# EAGLE design MotionBoard Rev B (EAGLE 7.3.0)

## Sheet 1 of 2
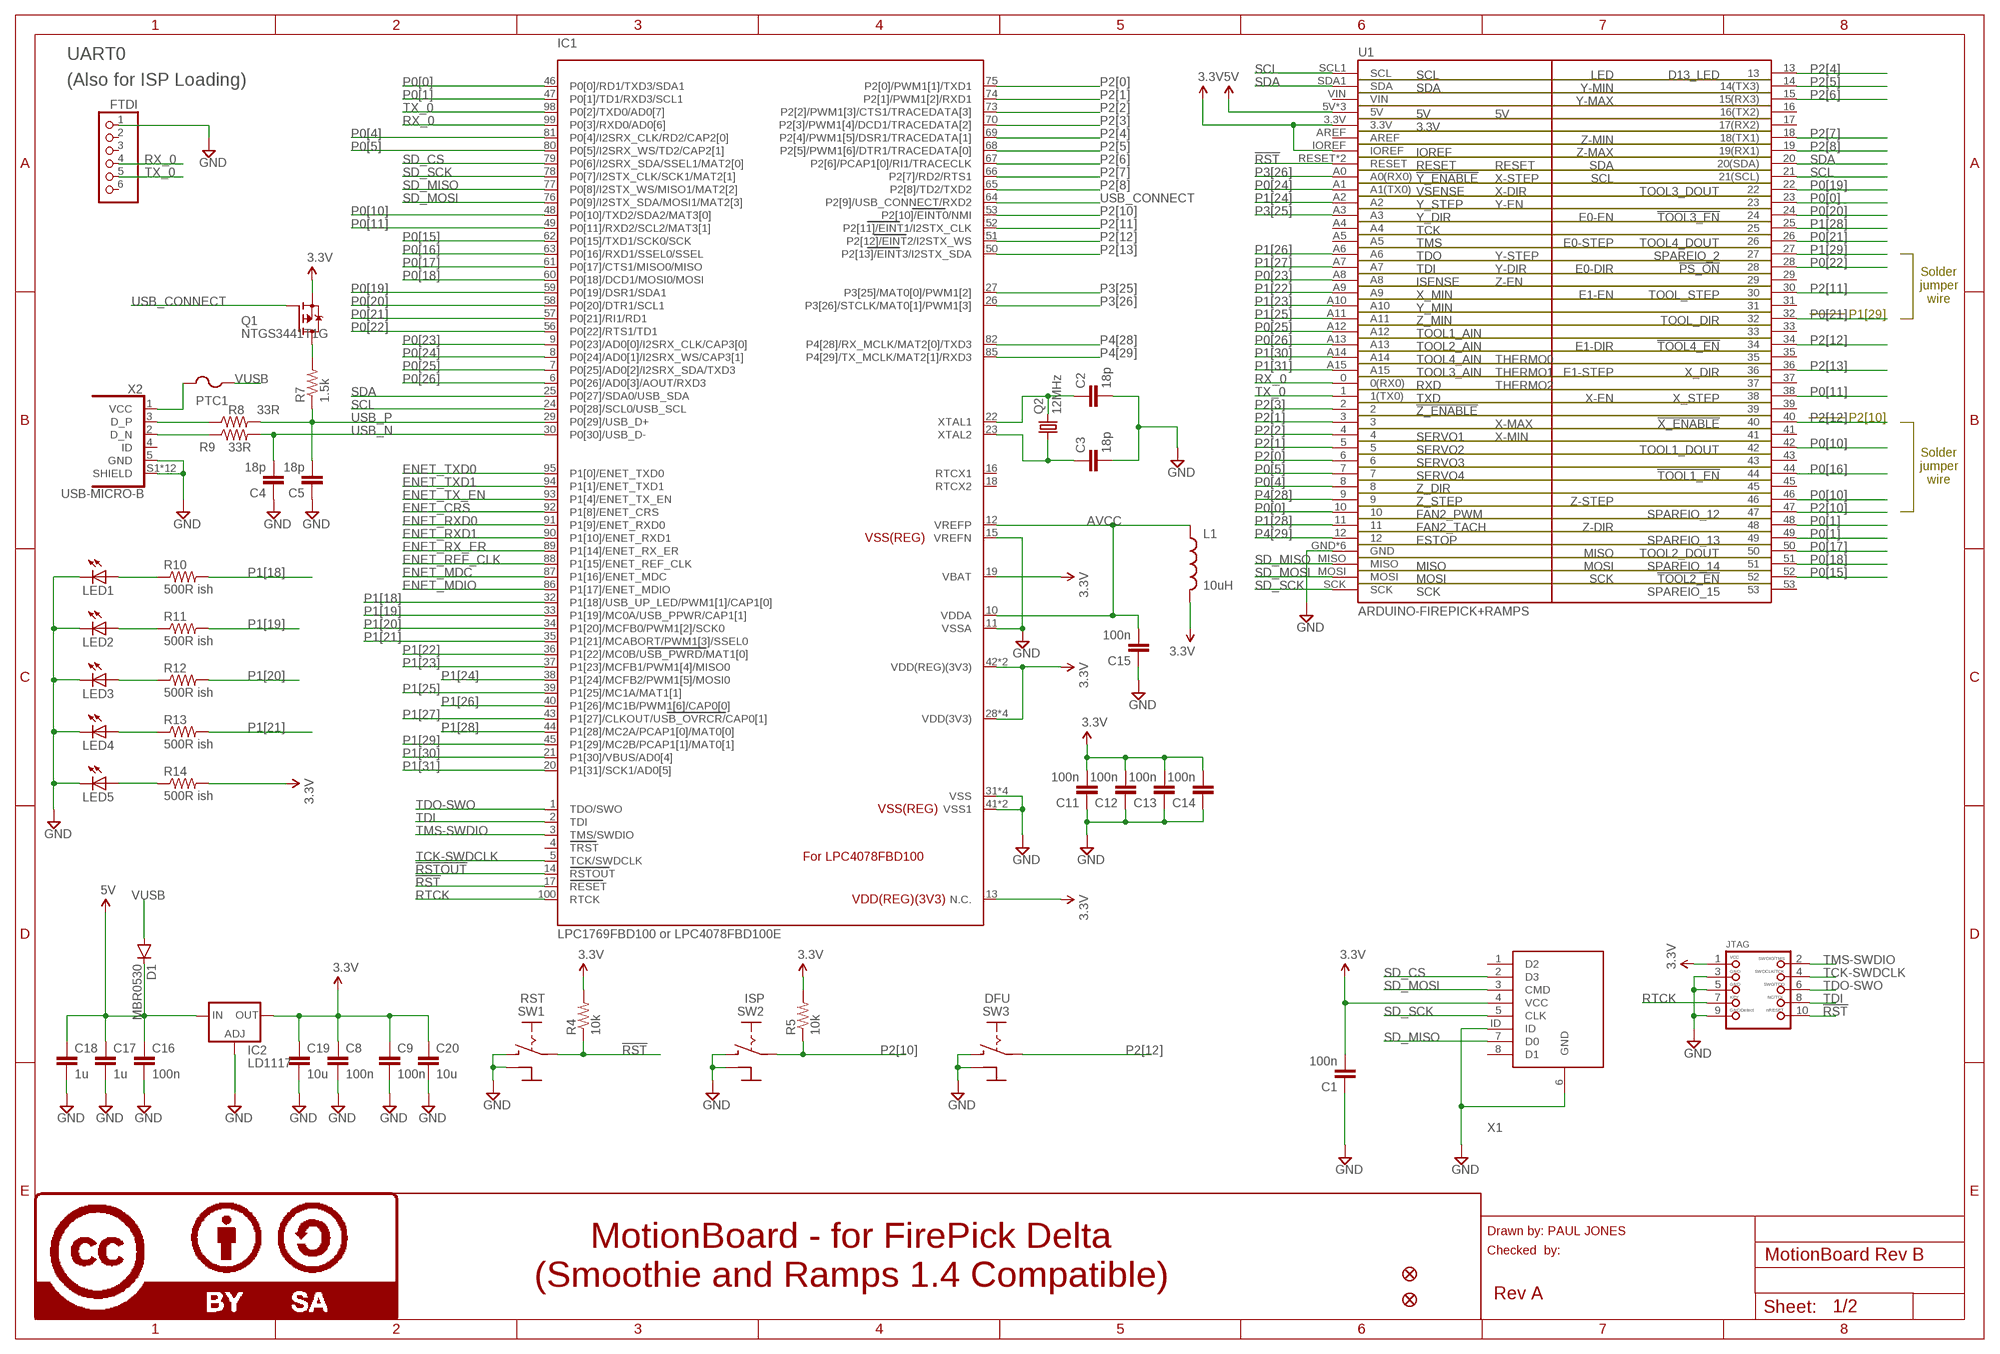
[diagram p0: schematic, sheet 1]

### Parts
C1  100n  CAP0603  [0603]
C2  18p  CAP0603  [0603]
C3  18p  CAP0603  [0603]
C4  18p  CAP0603  [0603]
C5  18p  CAP0603  [0603]
C8  100n  CAP0603  [0603]
C9  100n  CAP0603  [0603]
C11  100n  CAP0603  [0603]
C12  100n  CAP0603  [0603]
C13  100n  CAP0603  [0603]
C14  100n  CAP0603  [0603]
C15  100n  CAP0603  [0603]
C16  100n  CAP0603  [0603]
C17  1u  CAP0603  [0603]
C18  1u  CAP0603  [0603]
C19  10u  CAP0603  [0603]
C20  10u  CAP0603  [0603]
D1  MBR0530  DIODESOD123  [SOD-123]
DFU  SW3  TOGGLE-SW-SMD  [TOGGLE-SW-SMD]
FID5  FIDUCIAL1X2  [FIDUCIAL-1X2]
FID6  FIDUCIAL1X2  [FIDUCIAL-1X2]
FTDI  PINHD-1X6  [1X06]
IC1  LPC1769FBD100 or LPC4078FBD100E  LPC1768  [LQFP100]
IC2  LD1117  LD117AS12TR  [SOT223]
ISP  SW2  TOGGLE-SW-SMD  [TOGGLE-SW-SMD]
JTAG  JTAG-CORTEXM3  [2X05_1.27MM_SMT]
L1  10uH  INDUCTOR0603  [0603]
LED1  LED  [LED-1206-BOTTOM]
LED2  LED  [LED-1206-BOTTOM]
LED3  LED  [LED-1206-BOTTOM]
LED4  LED  [LED-1206-BOTTOM]
LED5  LED  [LED-1206-BOTTOM]
LOGO6  LOGO-CC-BY-SAMEDIUM  [LOGO-CC-BY-SA-MEDIUM]
PTC1  PTCFUSE-1812  [1812]
Q1  NTGS3441T1G  BSL207SP  [SC74_INFINEON]
Q2  12MHz  CRYSTALHC49UP  [HC49UP]
R4  10k  R-US_R0603  [R0603]
R5  10k  R-US_R0603  [R0603]
R7  1.5k  R-US_R0603  [R0603]
R8  33R  R-US_R0603  [R0603]
R9  33R  R-US_R0603  [R0603]
R10  500R ish  R-US_R0603  [R0603]
R11  500R ish  R-US_R0603  [R0603]
R12  500R ish  R-US_R0603  [R0603]
R13  500R ish  R-US_R0603  [R0603]
R14  500R ish  R-US_R0603  [R0603]
RST  SW1  TOGGLE-SW-SMD  [TOGGLE-SW-SMD]
U1  ARDUINO-FIREPICK+RAMPS  [ARDUINO_MEGA_NEW]
X1  ST9S008V4AR1500  [ST9S008V4AR1500]
X2  USB-MICRO-B  [FCI-10118194-0001LF]

### Nets
3.3V: C1.2 C8.1 C9.1 C11.2 C12.2 C13.2 C14.2 C19.1 C20.1 IC1.13(N.C.) IC1.19(VBAT) IC1.28(VDD(3V3)) IC1.42(VDD(REG)(3V3)) IC1.54(VDD(3V3)) IC1.71(VDD(3V3)) IC1.84(VDD(REG)(3V3)) IC1.96(VDD(3V3)) IC2.4(OUT) JTAG.1 L1.2 Q1.4(S) R4.2 R5.2 R14.2 U1.3.3V U1.IOREF X1.4(VCC) ; also sheet 2
5V: C16.1 C17.1 C18.1 D1.C IC2.3(IN) U1.5V U1.5V@1(5V) U1.5V@2(5V)
!RST: IC1.17(RESET) JTAG.10 R4.1 RST.3(I) RST.4(I) U1.RESET U1.RST(RESET)
!RSTOUT: IC1.14(RSTOUT) ; also sheet 2
AVCC: C15.2 IC1.10(VDDA) IC1.12(VREFP) L1.1
D_N: R9.1 X2.2(D_N)
D_P: R8.1 X2.3(D_P)
ENET_CRS: IC1.92(P1[8]/ENET_CRS) ; also sheet 2
ENET_MDC: IC1.87(P1[16]/ENET_MDC) ; also sheet 2
ENET_MDIO: IC1.86(P1[17]/ENET_MDIO) ; also sheet 2
ENET_REF_CLK: IC1.88(P1[15]/ENET_REF_CLK) ; also sheet 2
ENET_RX_ER: IC1.89(P1[14]/ENET_RX_ER) ; also sheet 2
ENET_RXD0: IC1.91(P1[9]/ENET_RXD0) ; also sheet 2
ENET_RXD1: IC1.90(P1[10]/ENET_RXD1) ; also sheet 2
ENET_TX_EN: IC1.93(P1[4]/ENET_TX_EN) ; also sheet 2
ENET_TXD0: IC1.95(P1[0]/ENET_TXD0) ; also sheet 2
ENET_TXD1: IC1.94(P1[1]/ENET_TXD1) ; also sheet 2
GND: C1.1 C2.2 C3.2 C4.1 C5.1 C8.2 C9.2 C11.1 C12.1 C13.1 C14.1 C15.1 C16.2 C17.2 C18.2 C19.2 C20.2 DFU.1(C) DFU.2(C) DFU.GND FTDI.1 IC1.11(VSSA) IC1.15(VREFN) IC1.31(VSS) IC1.41(VSS1) IC1.55(VSS) IC1.72(VSS) IC1.83(VSS1) IC1.97(VSS) IC2.1(ADJ) ISP.1(C) ISP.2(C) ISP.GND JTAG.3 JTAG.5 JTAG.9 LED1.C LED2.C LED3.C LED4.C LED5.C RST.1(C) RST.2(C) RST.GND U1.GND U1.GND@0(GND) U1.GND@1(GND) U1.GND@2(GND) U1.GND@3(GND) U1.GNDI(GND) X1.6(GND) X1.ID X2.5(GND) X2.S1(SHIELD) X2.S2(SHIELD) X2.S3(SHIELD) X2.S4(SHIELD) X2.S5(SHIELD) X2.S6(SHIELD) X2.S7(SHIELD) X2.S8(SHIELD) X2.S9(SHIELD) X2.S10(SHIELD) X2.S11(SHIELD) X2.S12(SHIELD) ; also sheet 2
N$1: C2.1 IC1.22(XTAL1) Q2.2
N$2: C3.1 IC1.23(XTAL2) Q2.1
N$9: PTC1.2 X2.1(VCC)
N$51: Q1.1(D) Q1.2(D) Q1.5(D) Q1.6(D) R7.2
N$80: LED5.A R14.1
N$84: LED4.A R13.1
N$85: LED3.A R12.1
N$86: LED2.A R11.1
N$87: LED1.A R10.1
P0[0]: IC1.46(P0[0]/RD1/TXD3/SDA1) U1.10 U1.23
P0[1]: IC1.47(P0[1]/TD1/RXD3/SCL1) U1.48 U1.49
P0[4]: IC1.81(P0[4]/I2SRX_CLK/RD2/CAP2[0]) U1.8
P0[5]: IC1.80(P0[5]/I2SRX_WS/TD2/CAP2[1]) U1.7
P0[10]: IC1.48(P0[10]/TXD2/SDA2/MAT3[0]) U1.42 U1.46
P0[11]: IC1.49(P0[11]/RXD2/SCL2/MAT3[1]) U1.38
P0[15]: IC1.62(P0[15]/TXD1/SCK0/SCK) U1.52
P0[16]: IC1.63(P0[16]/RXD1/SSEL0/SSEL) U1.44
P0[17]: IC1.61(P0[17]/CTS1/MISO0/MISO) U1.50
P0[18]: IC1.60(P0[18]/DCD1/MOSI0/MOSI) U1.51
P0[19]: IC1.59(P0[19]/DSR1/SDA1) U1.22
P0[20]: IC1.58(P0[20]/DTR1/SCL1) U1.24
P0[21]: IC1.57(P0[21]/RI1/RD1) U1.26 U1.32
P0[22]: IC1.56(P0[22]/RTS1/TD1) U1.28
P0[23]: IC1.9(P0[23]/AD0[0]/I2SRX_CLK/CAP3[0]) U1.A8
P0[24]: IC1.8(P0[24]/AD0[1]/I2SRX_WS/CAP3[1]) U1.A1(A1(TX0))
P0[25]: IC1.7(P0[25]/AD0[2]/I2SRX_SDA/TXD3) U1.A12
P0[26]: IC1.6(P0[26]/AD0[3]/AOUT/RXD3) U1.A13
P1[18]: IC1.32(P1[18]/USB_UP_LED/PWM1[1]/CAP1[0]) R10.2
P1[19]: IC1.33(P1[19]/MC0A/USB_PPWR/CAP1[1]) R11.2
P1[20]: IC1.34(P1[20]/MCFB0/PWM1[2]/SCK0) R12.2
P1[21]: IC1.35(P1[21]/MCABORT/PWM1[3]/SSEL0) R13.2
P1[22]: IC1.36(P1[22]/MC0B/USB_PWRD/MAT1[0]) U1.A9
P1[23]: IC1.37(P1[23]/MCFB1/PWM1[4]/MISO0) U1.A10
P1[24]: IC1.38(P1[24]/MCFB2/PWM1[5]/MOSI0) U1.A2
P1[25]: IC1.39(P1[25]/MC1A/MAT1[1]) U1.A11
P1[26]: IC1.40(P1[26]/MC1B/PWM1[6]/CAP0[0]) U1.A6
P1[27]: IC1.43(P1[27]/CLKOUT/USB_OVRCR/CAP0[1]) U1.A7
P1[28]: IC1.44(P1[28]/MC2A/PCAP1[0]/MAT0[0]) U1.11 U1.25
P1[29]: IC1.45(P1[29]/MC2B/PCAP1[1]/MAT0[1]) U1.27
P1[30]: IC1.21(P1[30]/VBUS/AD0[4]) U1.A14
P1[31]: IC1.20(P1[31]/SCK1/AD0[5]) U1.A15
P2[0]: IC1.75(P2[0]/PWM1[1]/TXD1) U1.6
P2[1]: IC1.74(P2[1]/PWM1[2]/RXD1) U1.3 U1.5
P2[2]: IC1.73(P2[2]/PWM1[3]/CTS1/TRACEDATA[3]) U1.4
P2[3]: IC1.70(P2[3]/PWM1[4]/DCD1/TRACEDATA[2]) U1.2
P2[4]: IC1.69(P2[4]/PWM1[5]/DSR1/TRACEDATA[1]) U1.13
P2[5]: IC1.68(P2[5]/PWM1[6]/DTR1/TRACEDATA[0]) U1.14(14(TX3))
P2[6]: IC1.67(P2[6]/PCAP1[0]/RI1/TRACECLK) U1.15(15(RX3))
P2[7]: IC1.66(P2[7]/RD2/RTS1) U1.18(18(TX1))
P2[8]: IC1.65(P2[8]/TD2/TXD2) U1.19(19(RX1))
P2[10]: IC1.53(P2[10]/EINT0/NMI) ISP.3(I) ISP.4(I) R5.1 U1.47
P2[11]: IC1.52(P2[11]/EINT1/I2STX_CLK) U1.30
P2[12]: DFU.3(I) DFU.4(I) IC1.51(P2[12]/EINT2/I2STX_WS) U1.34 U1.40
P2[13]: IC1.50(P2[13]/EINT3/I2STX_SDA) U1.36
P3[25]: IC1.27(P3[25]/MAT0[0]/PWM1[2]) U1.A3
P3[26]: IC1.26(P3[26]/STCLK/MAT0[1]/PWM1[3]) U1.A0(A0(RX0))
P4[28]: IC1.82(P4[28]/RX_MCLK/MAT2[0]/TXD3) U1.9
P4[29]: IC1.85(P4[29]/TX_MCLK/MAT2[1]/RXD3) U1.12
RTCK: IC1.100(RTCK) JTAG.7
RX_0: FTDI.4 IC1.99(P0[3]/RXD0/AD0[6]) U1.0(0(RX0))
SCL: IC1.24(P0[28]/SCL0/USB_SCL) U1.21(21(SCL)) U1.SCL1(SCL)
SD_CS: IC1.79(P0[6]/I2SRX_SDA/SSEL1/MAT2[0]) X1.2(D3)
SD_MISO: IC1.77(P0[8]/I2STX_WS/MISO1/MAT2[2]) U1.MISO X1.7(D0)
SD_MOSI: IC1.76(P0[9]/I2STX_SDA/MOSI1/MAT2[3]) U1.MOSI X1.3(CMD)
SD_SCK: IC1.78(P0[7]/I2STX_CLK/SCK1/MAT2[1]) U1.SCK X1.5(CLK)
SDA: IC1.25(P0[27]/SDA0/USB_SDA) U1.20(20(SDA)) U1.SDA1(SDA)
TCK-SWDCLK: IC1.5(TCK/SWDCLK) JTAG.4
TDI: IC1.2(TDI) JTAG.8
TDO-SWO: IC1.1(TDO/SWO) JTAG.6
TMS-SWDIO: IC1.3(TMS/SWDIO) JTAG.2
TX_0: FTDI.5 IC1.98(P0[2]/TXD0/AD0[7]) U1.1(1(TX0))
USB_CONNECT: IC1.64(P2[9]/USB_CONNECT/RXD2) Q1.3(G)
USB_N [USB]: C4.2 IC1.30(P0[30]/USB_D-) R9.2
USB_P [USB]: C5.2 IC1.29(P0[29]/USB_D+) R7.1 R8.2
VUSB: D1.A PTC1.1
Unconnected: FTDI.2 FTDI.3 FTDI.6 IC1.4(TRST) IC1.16(RTCX1) IC1.18(RTCX2) U1.16(16(TX2)) U1.17(17(RX2)) U1.29 U1.31 U1.33 U1.35 U1.37 U1.39 U1.41 U1.43 U1.45 U1.53 U1.A4 U1.A5 U1.AREF U1.VIN X1.1(D2) X1.8(D1) X2.4(ID)

### Notes on the sheet
- UART0
- (Also for ISP Loading)
- Solder
  jumper
  wire
- P1[29]
- P2[10]
- Solder
  jumper
  wire
- Drawn by: PAUL JONES
- MotionBoard - for FirePick Delta
  (Smoothie and Ramps 1.4 Compatible)
- Checked  by:
- Rev A

## Sheet 2 of 2
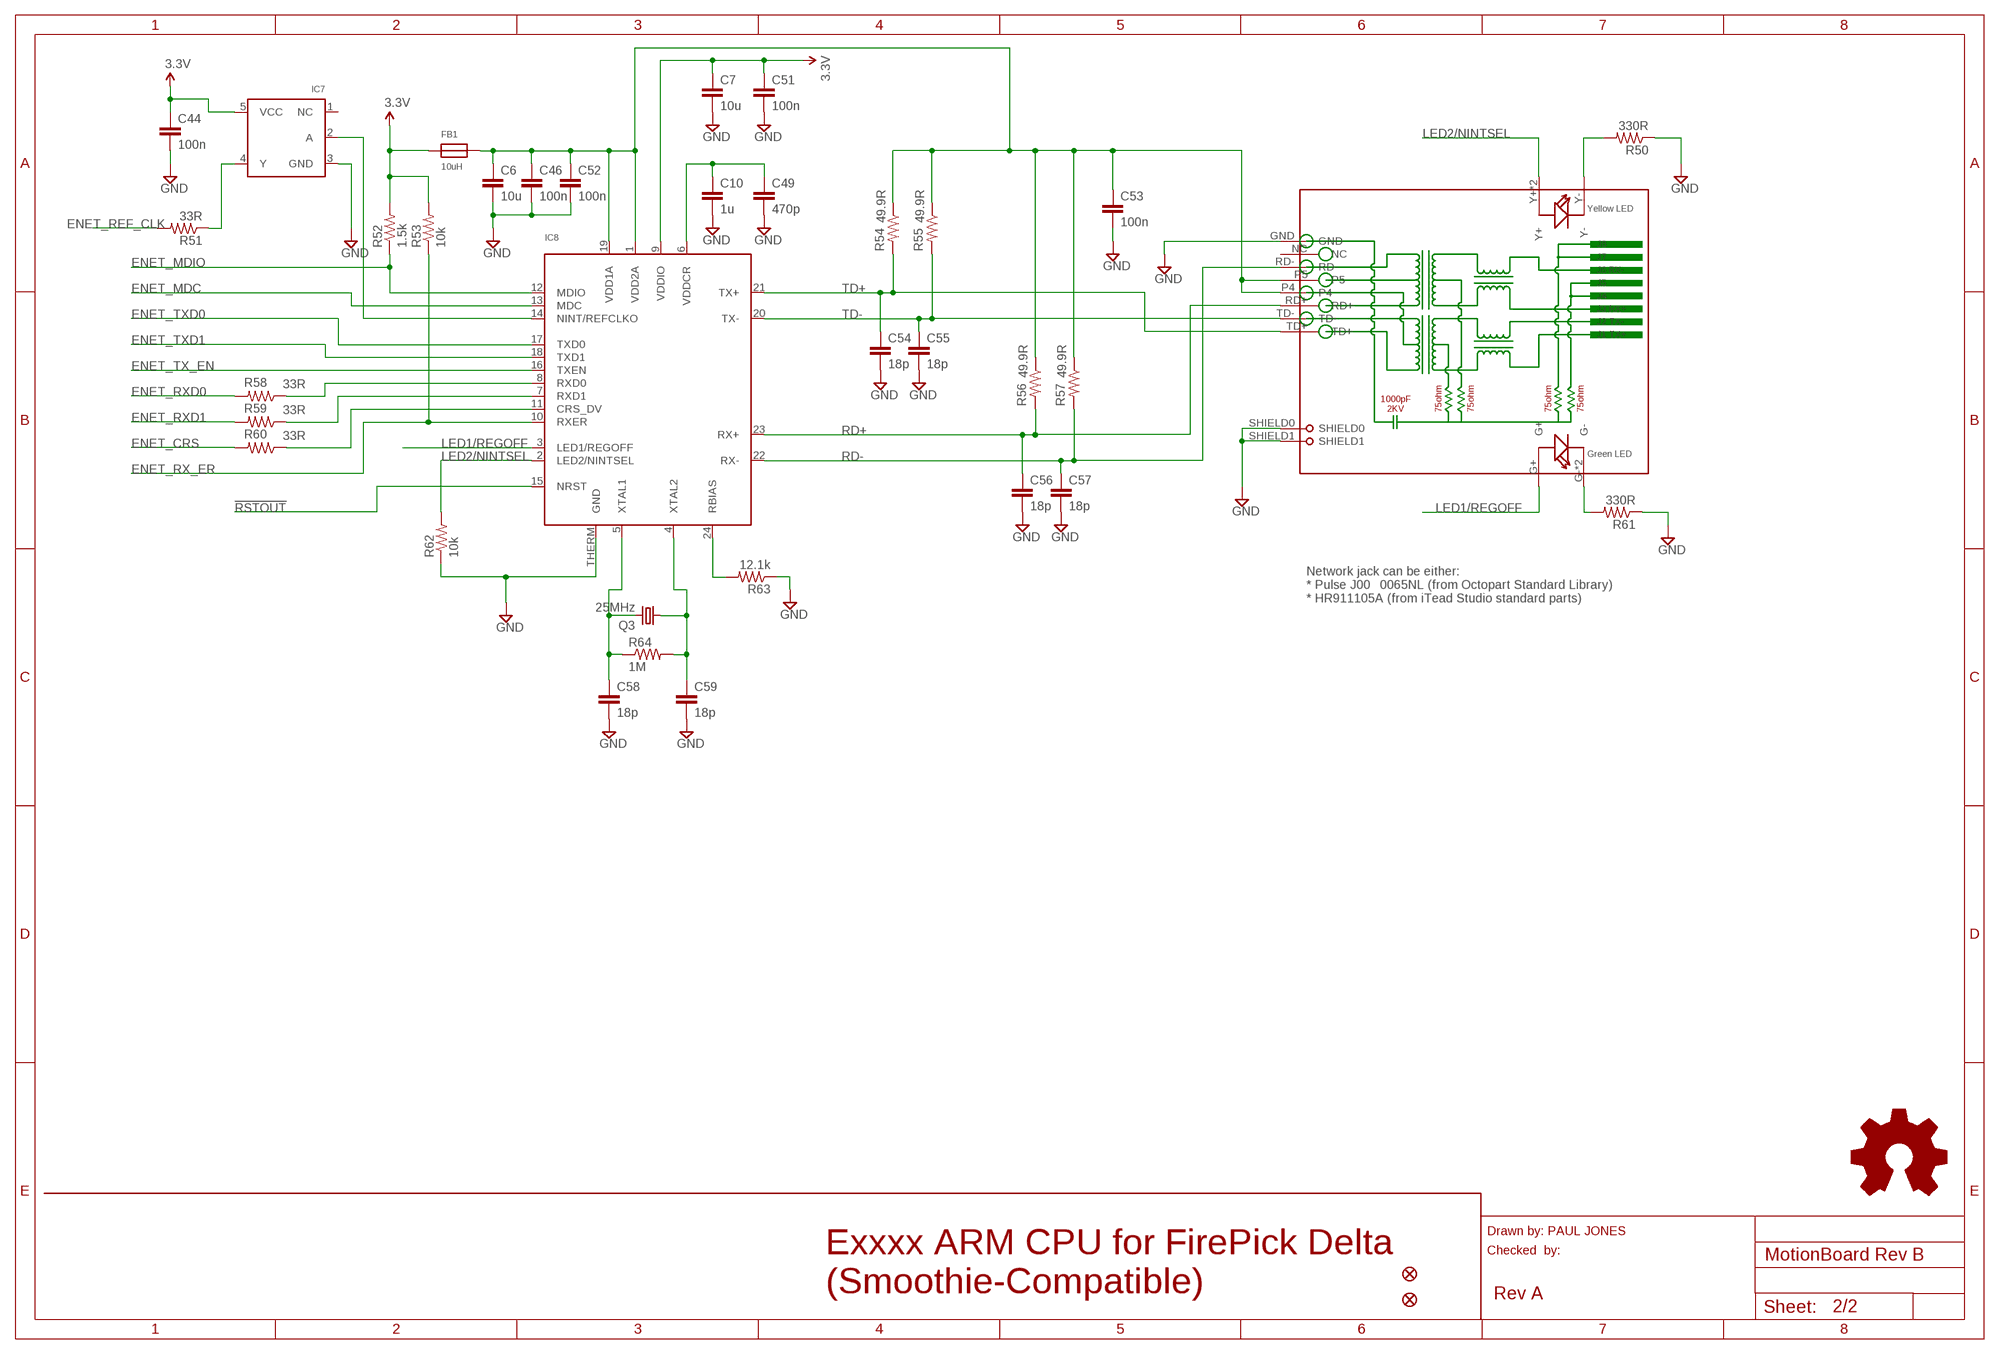
[diagram p1: schematic, sheet 2]

### Parts
C6  10u  CAP0603  [0603]
C7  10u  CAP0603  [0603]
C10  1u  CAP0603  [0603]
C44  100n  CAP0603  [0603]
C46  100n  CAP0603  [0603]
C49  470p  CAP0603  [0603]
C51  100n  CAP0603  [0603]
C52  100n  CAP0603  [0603]
C53  100n  CAP0603  [0603]
C54  18p  CAP0603  [0603]
C55  18p  CAP0603  [0603]
C56  18p  CAP0603  [0603]
C57  18p  CAP0603  [0603]
C58  18p  CAP0603  [0603]
C59  18p  CAP0603  [0603]
FB1  10uH  FERRITE  [0603]
FID17  FIDUCIAL1X2  [FIDUCIAL-1X2]
FID18  FIDUCIAL1X2  [FIDUCIAL-1X2]
IC7  74LVC1G04  [SOT23-5]
IC8  LAN8720  [QFN24_4MM]
LOGO10  LOGO-OSHWSMALL  [LOGO-OSHW-SMALL]
Q3  25MHz  CRYSTALHC49UP  [HC49UP]
R50  330R  R-US_R0603  [R0603]
R51  33R  R-US_R0603  [R0603]
R52  1.5k  R-US_R0603  [R0603]
R53  10k  R-US_R0603  [R0603]
R54  49.9R  R-US_R0603  [R0603]
R55  49.9R  R-US_R0603  [R0603]
R56  49.9R  R-US_R0603  [R0603]
R57  49.9R  R-US_R0603  [R0603]
R58  33R  R-US_R0603  [R0603]
R59  33R  R-US_R0603  [R0603]
R60  33R  R-US_R0603  [R0603]
R61  330R  R-US_R0603  [R0603]
R62  10k  R-US_R0603  [R0603]
R63  12.1k  R-US_R0603  [R0603]
R64  1M  R-US_R0603  [R0603]
RJ1  HR911105A  [HR911105A]

### Nets
3.3V: C7.1 C44.1 C51.1 FB1.1 IC7.5(VCC) IC8.9(VDDIO) R52.2 R53.2 ; also sheet 1
!RSTOUT: IC8.15(NRST) ; also sheet 1
ENET_CRS: R60.2 ; also sheet 1
ENET_MDC: IC8.13(MDC) ; also sheet 1
ENET_MDIO: IC8.12(MDIO) R52.1 ; also sheet 1
ENET_REF_CLK: R51.2 ; also sheet 1
ENET_RX_ER: IC8.10(RXER) R53.1 ; also sheet 1
ENET_RXD0: R58.2 ; also sheet 1
ENET_RXD1: R59.2 ; also sheet 1
ENET_TX_EN: IC8.16(TXEN) ; also sheet 1
ENET_TXD0: IC8.17(TXD0) ; also sheet 1
ENET_TXD1: IC8.18(TXD1) ; also sheet 1
GND: C6.2 C7.2 C10.2 C44.2 C46.2 C49.2 C51.2 C52.2 C53.2 C54.2 C55.2 C56.2 C57.2 C58.2 C59.2 IC7.3(GND) IC8.THERM(GND) R50.1 R61.1 R62.1 R63.1 RJ1.GND RJ1.SHIELD0 RJ1.SHIELD1 ; also sheet 1
LED1/REGOFF: IC8.3(LED1/REGOFF) RJ1.G+
LED2/NINTSEL: IC8.2(LED2/NINTSEL) R62.2 RJ1.Y+ RJ1.Y++(Y+)
N$3: IC8.11(CRS_DV) R60.1
N$4: IC8.24(RBIAS) R63.2
N$12: C10.1 C49.1 IC8.6(VDDCR)
N$15: IC7.2(A) IC8.14(NINT/REFCLKO)
N$20: R61.2 RJ1.G- RJ1.G--(G-)
N$42: IC8.8(RXD0) R58.1
N$47: R50.2 RJ1.Y-
N$55: IC8.7(RXD1) R59.1
N$67: C59.1 IC8.4(XTAL2) Q3.1 R64.2
N$68: C58.1 IC8.5(XTAL1) Q3.2 R64.1
N$78: IC7.4(Y) R51.1
RD+: C56.1 IC8.23(RX+) R56.2 RJ1.RD+
RD-: C57.1 IC8.22(RX-) R57.2 RJ1.RD-
TD+: C54.1 IC8.21(TX+) R54.2 RJ1.TD+
TD-: C55.1 IC8.20(TX-) R55.2 RJ1.TD-
VDD: C6.1 C46.1 C52.1 C53.1 FB1.2 IC8.1(VDD2A) IC8.19(VDD1A) R54.1 R55.1 R56.1 R57.1 RJ1.P4 RJ1.P5
Unconnected: IC7.1(NC) RJ1.NC

### Notes on the sheet
- Network jack can be either:
  * Pulse J00‑0065NL (from Octopart Standard Library)
  * HR911105A (from iTead Studio standard parts)
- Drawn by: PAUL JONES
- Checked  by:
- Exxxx ARM CPU for FirePick Delta
  (Smoothie-Compatible)
- Rev A

## Library data of the parts
C1-C20 C44 C46 C49 C51-C59 = iwt:CAP: Capacitor Standard 0603 ceramic capacitor, and 0.1" leaded capacitor.
D1 = SparkFun-DiscreteSemi:DIODE: Diode These are standard reverse protection diodes and small signal diodes. SMA package can handle up to about 1A. SOD-323 can handle about 200mA. What the SOD-323 package when ordering, there are some mfgs out there that are 5-pin packages.
DFU ISP RST = iwt:TOGGLE-SW-SMD
FB1 = microbuilder:FERRITE: Ferrite Bead 0603 120 Ohm, 600mA Ferrite Chip - Digikey: 445-2164-1-ND
FID5 FID6 FID17 FID18 = SparkFun-Aesthetics:FIDUCIAL: Fiducial Alignment Points Various fiducial points for machine vision alignment.
FTDI = pinhead:PINHD-1X6: PIN HEADER
IC1 = iwt:LPC1768: LPC1768 100 MHz 32-bit ARM Cortex-M3 based microcontroller featuring a high level of integration and low power consumption. 512 kB Flash, 64 kB SRAM, USB Device/Host/OTG, Ethernet, CAN, I2S, 10-bit DAC Digikey: 568-4796-ND
IC2 = v-reg:LD117A?*: Low drop fixed and adjustable positive voltage regulators 1 A Source: http://www.st.com/stonline/products/literature/ds/7194/ld1117axx.pdf
IC7 = microbuilder:74LVC1G04: 74LVC1G04 - Single Inverter Gate SOT23-5 SN74LVC1G04DBVR - Digikey: 296-11599-1-ND
IC8 = microbuilder:LAN8720: LAN8720A 10/100 Ethernet PHY Mouser: 886-LAN8720AI-CP
JTAG = microbuilder:JTAG-CORTEXM3: Serial Wire (SW-DP) Connector This standard 0.05" 10-pin connector is for use with the Cortex M0/M3's native SWD (serial wire debugger) interface (SW-DP). Some boards support a 20-pin combined JTAG+SWD connector (SWJ-DP), such as the LPC1700 family, but many smaller devices only work with SWD which typically use the smaller 10-pin SW-DP connecter (the LPC1300 family, for example, only supports SWD). 2x05 1.27mm/0.05" Connector: This is the standard SMT connector defined by ARM for all Cortex devices, and should be used in most situations and for forward-compatibility since any new devices coming to market will likely use this connector. MOLEX 10 Pin 0.1" Connector: This 0.1" 10 pin connector has the same pin layout as the standard 0.05" connector, but is easier to work with if you are using standard jumper wires or custom cables to connect your SWD hardware. MOLEX 20 Pin 0.1" Connector: This 0.1" 20 pin connector is the same model used for ARM7/ARM9 JTAG debuggers, but is connected to match the pins on the Segger J-Link for ARM (which supports both JTAG and SWD debugging). See the following document from ARM for more information on Cortex M3 Debug Connectors: http://infocenter.arm.com/help/topic/com.arm.doc.faqs/attached/13634/cortex_debug_connectors.pdf And the following page for an overview with images of the different connector types: http://www.keil.com/peripherals/coresight/connectors.asp
L1 = SparkFun:INDUCTOR: Inductors Basic Inductor/Choke - 0603 and 1206. Footprints are not proven and vary greatly between part numbers.
LED1-LED5 = iwt:LED: LEDs Standard schematic elements and footprints for 5mm, 3mm, 1206, and 0603 sized LEDs. 5mm - Spark Fun Electronics SKU : COM-00529 (and others)
LOGO6 = FirePick:LOGO-CC-BY-SA
LOGO10 = FirePick:LOGO-OSHW
PTC1 = adafruit:PTCFUSE: PTC fuses, resettable thermistors
Q1 = transistor-fet:BSL207SP: OptiMOS(R)-P Small-Signal-Transistor P-Channel, Enhancement mode, Super Logic Level (2.5 V rated) Source: http://www.infineon.com/upload/Document/BSL207SP_Rev2.01.pdf
Q2 Q3 = crystal:CRYSTAL: CRYSTAL; OC_FARNELL: unknown; OC_NEWARK: unknown
R4 R5 R7-R14 R50-R64 = resistor:R-US_: RESISTOR, American symbol
RJ1 = FirePick:HR911105A: SOC006
U1 = iwt:ARDUINO-FIREPICK+RAMPS
X1 = ST9S008V4AR1500-598396:ST9S008V4AR1500: http://octopart.com/st9s008v4ar1500-jae+electronics-19043725
X2 = iwt:USB-MICRO-B

## Net classes
1 USB: width 0.305 mm, drill 0.356 mm, clearance 0.254 mm
2 D: width 0.305 mm, drill 0.356 mm, clearance 0.254 mm

## Board
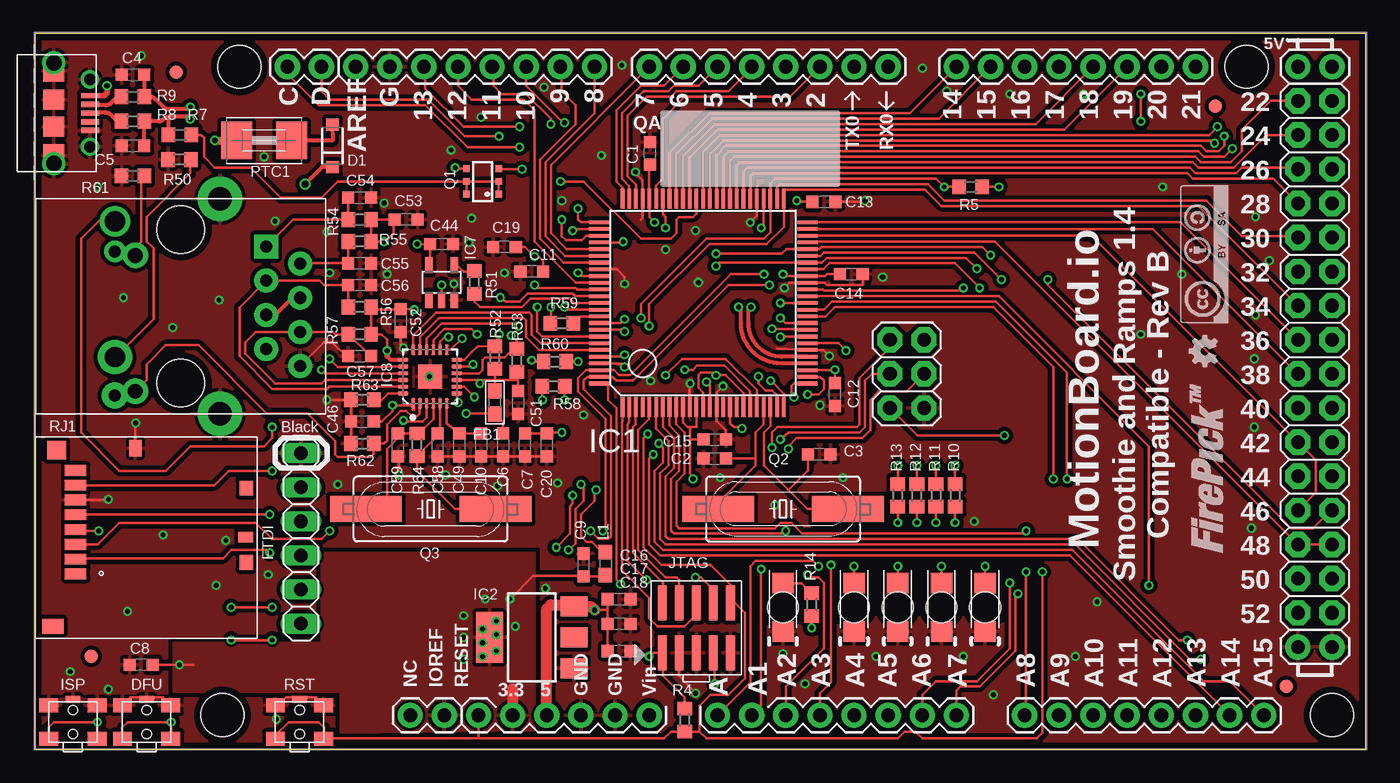
[diagram p2: board, top side]
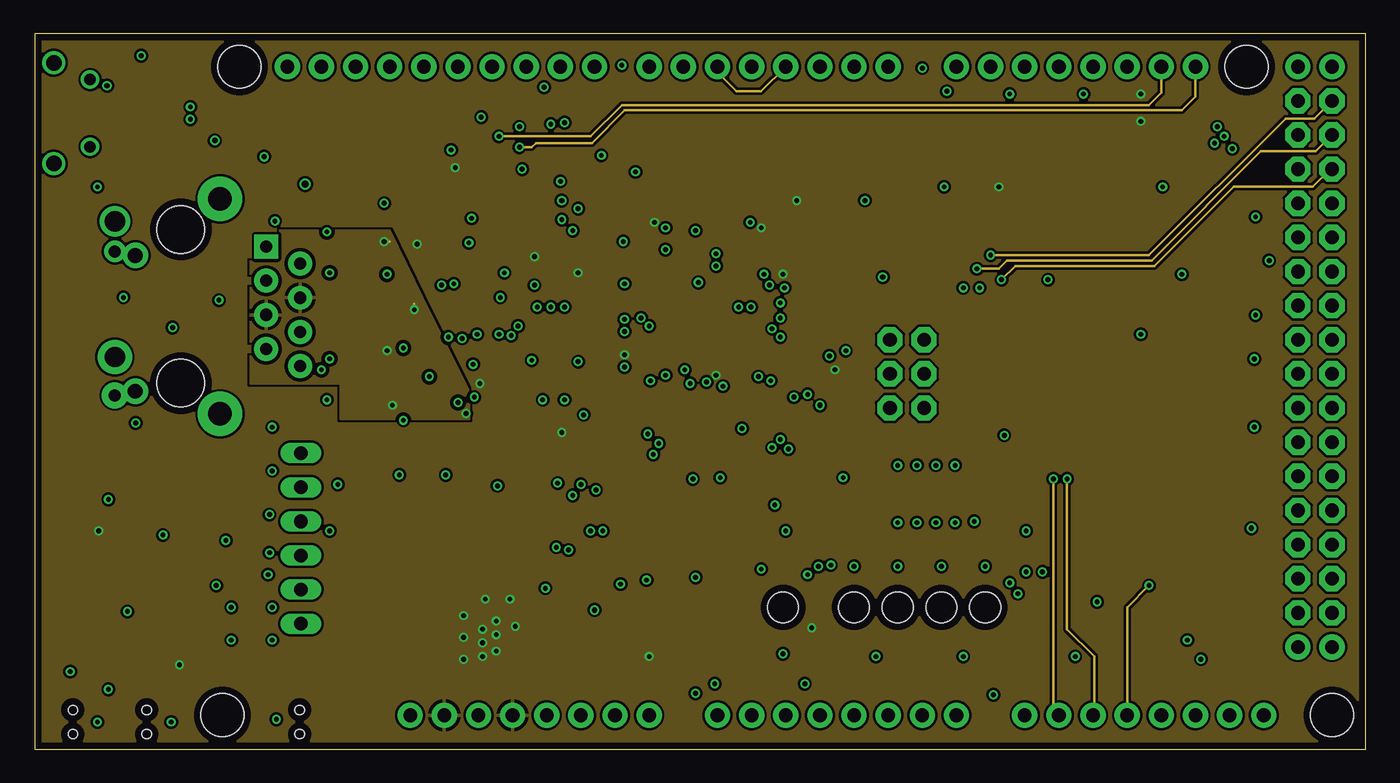
[diagram p3: board, inner layer 3.3]
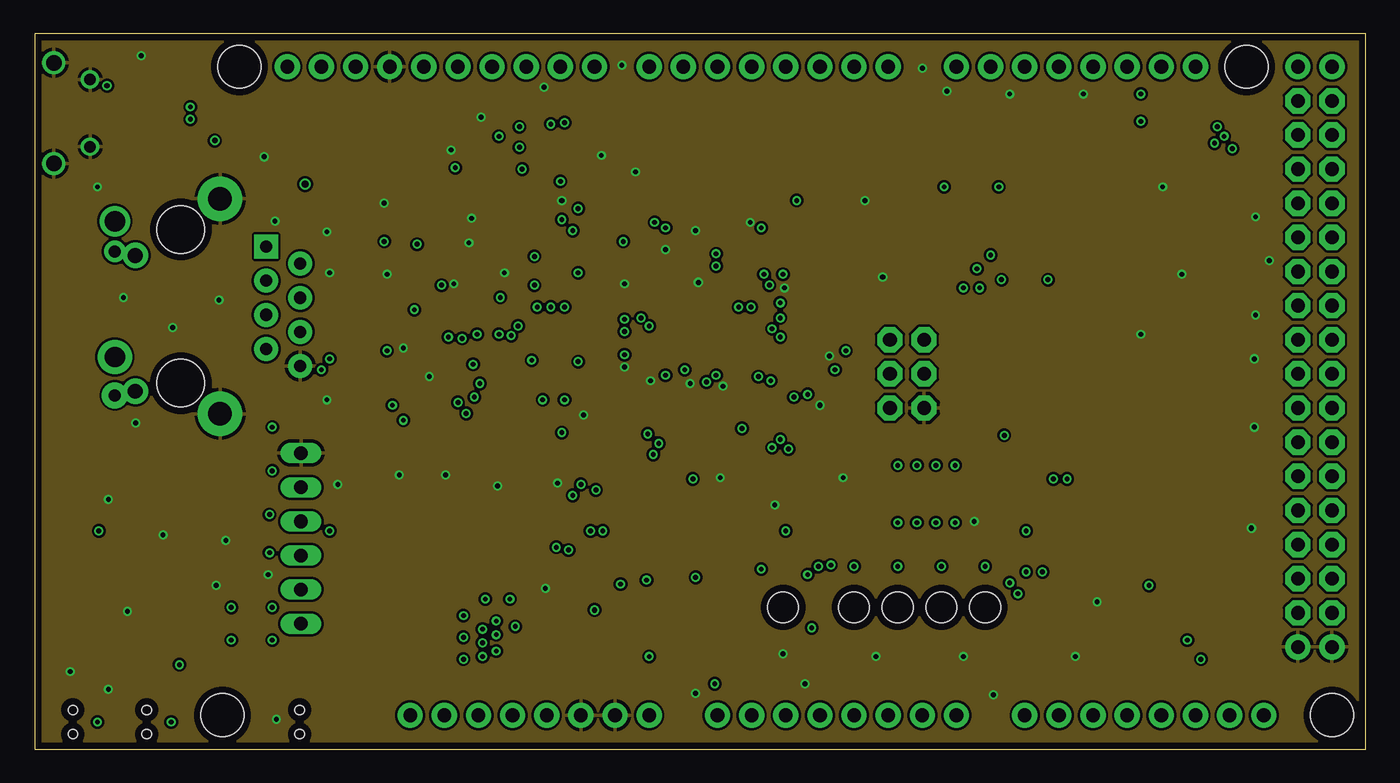
[diagram p4: board, inner layer Gnd]
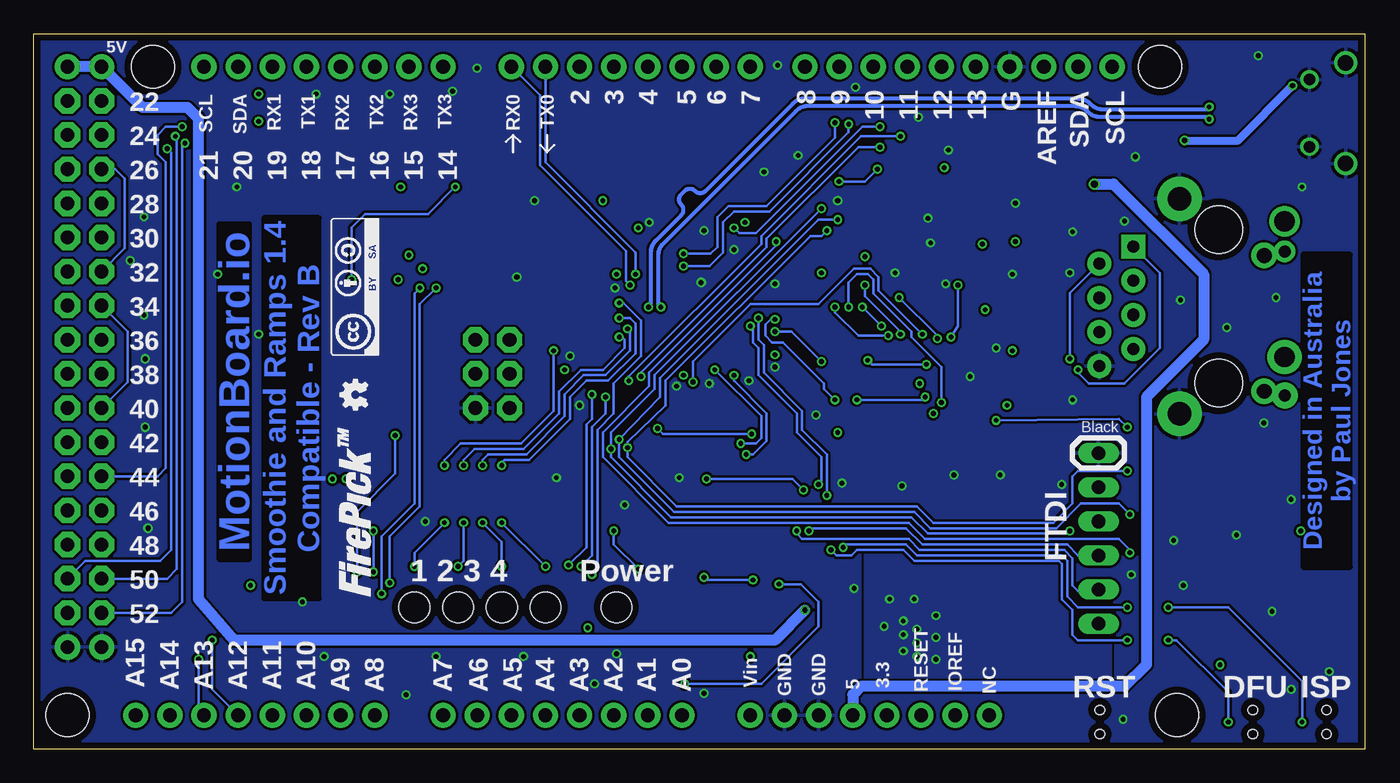
[diagram p5: board, bottom side, seen from below]

Size 99.04 x 53.26 mm. Coordinates in mm from the lower left corner, seen from the top.
Outline: 0,0 99.04,0 99.04,53.26 0,53.26 0,0
Copper layers (1*2*3*16): Top 0.035mm / dielectric 1.5mm / 3.3 0.035mm / dielectric 0.15mm / Gnd 0.035mm / dielectric 0.2mm / Bottom 0.035mm
Design rules "EagleRules *": minimum track width 8mil, minimum drill 12mil, track to track 7mil, track to pad 7mil, pad to pad 7mil, via to via 7mil, smd to smd 0mil, copper to edge 20mil, drill to drill 10mil, minimum pad ring 10mil, minimum via ring 6mil, stop-mask expansion 2mil, vias tented up to drill 25mil, thermal gap 10mil

### Footprints (pad centres in the part's own frame; a part is rotated, then mirrored left to right if it is on the bottom)
0603 = smd 0.9 x 0.9: 1 -0.85,0; 2 0.85,0
SOD-123 = smd 0.9 x 0.95: A 1.575,0; C -1.575,0
TOGGLE-SW-SMD = smd 1.4 x 1.05: 1 -1.8,1.25; 2 1.8,1.25; 3 -1.8,-1.25; 4 1.8,-1.25 | smd 1.1 x 0.5: GND 0,1.7 | hole 0.7: 0,0.9; 0,-0.9
0603' = smd 1.1 x 1: 1 -0.85,0; 2 0.85,0
FIDUCIAL-1X2 = smd 1 x 1: 1 0,0
1X06 = drill 1.016 long: 1 -6.35,0; 2 -3.81,0; 3 -1.27,0; 4 1.27,0; 5 3.81,0; 6 6.35,0
LQFP100 = smd 0.27 x 1.5: 1 -6,-7.75; 2 -5.5,-7.75; 3 -5,-7.75; 4 -4.5,-7.75; 5 -4,-7.75; 6 -3.5,-7.75; 7 -3,-7.75; 8 -2.5,-7.75; 9 -2,-7.75; 10 -1.5,-7.75; 11 -1,-7.75; 12 -0.5,-7.75; 13 0,-7.75; 14 0.5,-7.75; 15 1,-7.75; 16 1.5,-7.75; 17 2,-7.75; 18 2.5,-7.75; 19 3,-7.75; 20 3.5,-7.75; 21 4,-7.75; 22 4.5,-7.75; 23 5,-7.75; 24 5.5,-7.75; 25 6,-7.75; 51 6,7.75; 52 5.5,7.75; 53 5,7.75; 54 4.5,7.75; 55 4,7.75; 56 3.5,7.75; 57 3,7.75; 58 2.5,7.75; 59 2,7.75; 60 1.5,7.75; 61 1,7.75; 62 0.5,7.75; 63 0,7.75; 64 -0.5,7.75; 65 -1,7.75; 66 -1.5,7.75; 67 -2,7.75; 68 -2.5,7.75; 69 -3,7.75; 70 -3.5,7.75; 71 -4,7.75; 72 -4.5,7.75; 73 -5,7.75; 74 -5.5,7.75; 75 -6,7.75 | smd 1.5 x 0.27: 26 7.75,-6; 27 7.75,-5.5; 28 7.75,-5; 29 7.75,-4.5; 30 7.75,-4; 31 7.75,-3.5; 32 7.75,-3; 33 7.75,-2.5; 34 7.75,-2; 35 7.75,-1.5; 36 7.75,-1; 37 7.75,-0.5; 38 7.75,0; 39 7.75,0.5; 40 7.75,1; 41 7.75,1.5; 42 7.75,2; 43 7.75,2.5; 44 7.75,3; 45 7.75,3.5; 46 7.75,4; 47 7.75,4.5; 48 7.75,5; 49 7.75,5.5; 50 7.75,6; 76 -7.75,6; 77 -7.75,5.5; 78 -7.75,5; 79 -7.75,4.5; 80 -7.75,4; 81 -7.75,3.5; 82 -7.75,3; 83 -7.75,2.5; 84 -7.75,2; 85 -7.75,1.5; 86 -7.75,1; 87 -7.75,0.5; 88 -7.75,0; 89 -7.75,-0.5; 90 -7.75,-1; 91 -7.75,-1.5; 92 -7.75,-2; 93 -7.75,-2.5; 94 -7.75,-3; 95 -7.75,-3.5; 96 -7.75,-4; 97 -7.75,-4.5; 98 -7.75,-5; 99 -7.75,-5.5; 100 -7.75,-6
SOT223 = smd 1.5 x 2: 1 -2.3,-3.15; 2 0,-3.15; 3 2.3,-3.15 | smd 3.8 x 2: 4 0,3.15
SOT23-5 = smd 0.55 x 1.2: 1 -0.95,-1.3; 2 0,-1.3; 3 0.95,-1.3; 4 0.95,1.3; 5 -0.95,1.3
QFN24_4MM = smd 0.8 x 0.28: 1 -2,1.25; 2 -2,0.75; 3 -2,0.25; 4 -2,-0.25; 5 -2,-0.75; 6 -2,-1.25; 13 2,-1.25; 14 2,-0.75; 15 2,-0.25; 16 2,0.25; 17 2,0.75; 18 2,1.25 | smd 0.28 x 0.8: 7 -1.25,-2; 8 -0.75,-2; 9 -0.25,-2; 10 0.25,-2; 11 0.75,-2; 12 1.25,-2; 19 1.25,2; 20 0.75,2; 21 0.25,2; 22 -0.25,2; 23 -0.75,2; 24 -1.25,2 | smd 1.778 x 1.778: THERM 0,0
2X05_1.27MM_SMT = smd 0.65 x 2.6: 1 -2.54,-1.85; 2 -2.54,1.85; 3 -1.27,-1.85; 4 -1.27,1.85; 5 0,-1.85; 6 0,1.85; 7 1.27,-1.85; 8 1.27,1.85; 9 2.54,-1.85; 10 2.54,1.85
LED-1206-BOTTOM = smd 1.5 x 1.6: A -1.8,0; C 1.8,0 | hole 2.3: 0,0
1812 = smd 2.286 x 2.794: 1 -2.046,0; 2 2.046,0
SC74_INFINEON = smd 0.5 x 0.5: 1 -0.95,-1.2; 2 0,-1.2; 3 0.95,-1.2; 4 0.95,1.2; 5 0,1.2; 6 -0.95,1.2
HC49UP = smd 5.334 x 1.93: 1 -4.826,0; 2 4.826,0
R0603 = smd 1 x 1.1: 1 -0.85,0; 2 0.85,0
HR911105A = drill 1.5: G+ 6.325,4.9 | drill 0.9 pad 1.6: G- 4.085,4.9 | drill 1.1 pad 1.9: G-- 3.785,3.38; Y++ -6.325,3.38 | drill 0.9 pad 1.778: GND -4.445,-8.89; NC -3.175,-6.35; P4 0.635,-8.89; P5 -0.635,-6.35; RD+ 1.905,-6.35; RD- -1.905,-8.89; TD- 3.175,-8.89 | drill 1.76 pad 3.3: SHIELD0 -8.001,-2.921; SHIELD1 8.001,-2.921 | drill 0.9 pad 1.778 square: TD+ 4.445,-6.35 | drill 0.9 pad 1.93: Y+ -6.625,4.9 | drill 1.5 pad 2.54: Y- -3.785,4.9 | hole 3.556: 5.715,0; -5.715,0
ARDUINO_MEGA_NEW = drill 1.016 pad 1.88: 0 63.5,50.8; 1 60.96,50.8; 2 58.42,50.8; 3 55.88,50.8; 3.3V 35.56,2.54; 4 53.34,50.8; 5 50.8,50.8; 5V 38.1,2.54; 5V@1 93.98,50.8; 5V@2 96.52,50.8; 6 48.26,50.8; 7 45.72,50.8; 8 41.656,50.8; 9 39.116,50.8; 10 36.576,50.8; 11 34.036,50.8; 12 31.496,50.8; 13 28.956,50.8; 14 68.58,50.8; 15 71.12,50.8; 16 73.66,50.8; 17 76.2,50.8; 18 78.74,50.8; 19 81.28,50.8; 20 83.82,50.8; 21 86.36,50.8; A0 50.8,2.54; A1 53.34,2.54; A2 55.88,2.54; A3 58.42,2.54; A4 60.96,2.54; A5 63.5,2.54; A6 66.04,2.54; A7 68.58,2.54; A8 73.66,2.54; A9 76.2,2.54; A10 78.74,2.54; A11 81.28,2.54; A12 83.82,2.54; A13 86.36,2.54; A14 88.9,2.54; A15 91.44,2.54; AREF 23.876,50.8; GND 26.416,50.8; GND@0 40.64,2.54; GND@1 43.18,2.54; GND@2 93.98,7.62; GND@3 96.52,7.62; IOREF 30.48,2.54; NC 27.94,2.54; RESET 33.02,2.54; SCL1 18.796,50.8; SDA1 21.336,50.8; VIN 45.72,2.54 | drill 1.016 pad 1.88 octagon: 22 93.98,48.26; 23 96.52,48.26; 24 93.98,45.72; 25 96.52,45.72; 26 93.98,43.18; 27 96.52,43.18; 28 93.98,40.64; 29 96.52,40.64; 30 93.98,38.1; 31 96.52,38.1; 32 93.98,35.56; 33 96.52,35.56; 34 93.98,33.02; 35 96.52,33.02; 36 93.98,30.48; 37 96.52,30.48; 38 93.98,27.94; 39 96.52,27.94; 40 93.98,25.4; 41 96.52,25.4; 42 93.98,22.86; 43 96.52,22.86; 44 93.98,20.32; 45 96.52,20.32; 46 93.98,17.78; 47 96.52,17.78; 48 93.98,15.24; 49 96.52,15.24; 50 93.98,12.7; 51 96.52,12.7; 52 93.98,10.16; 53 96.52,10.16; GNDI 66.167,25.4; MISO 63.627,30.48; MOSI 66.167,27.94; RST 63.627,25.4; SCK 63.627,27.94; VCC 66.167,30.48 | hole 3.2: 15.24,50.8; 13.97,2.54; 90.17,50.8; 96.52,2.54
ST9S008V4AR1500 = smd 0.8 x 1.6: 1 3.2,0; 2 2.1,0; 3 1,0; 4 -0.1,0; 5 -1.2,0; 6 -2.3,0; 7 -3.4,0; 8 -4.5,0 | smd 1.2 x 0.9: ID -6.15,4.45 | smd 1.4 x 1.4: P$9 -6,-1.4 | smd 1.1 x 1.6: P$10 7.1,-1.7 | smd 1.1 x 1: P$12 -3.18,12.7; P$13 2.35,12.7 | smd 0.8 x 1.1: P$14 0.46,12.65
FCI-10118194-0001LF = smd 0.4 x 1.35: 1 -1.3,2.7; 2 -0.65,2.7; 3 0,2.7; 4 0.65,2.7; 5 1.3,2.7 | drill 0.85: S1 -2.5,2.7; S2 2.5,2.7 | drill 1.15: S3 -3.75,0; S8 3.75,0 | smd 1.65 x 1.55: S4 -3.15,0; S7 3.15,0 | smd 1.5 x 1.55: S5 -1,0; S6 1,0 | smd 1.2 x 1.2: S9 -2.5,2.69; S10 2.5,2.69 | smd 1.5 x 1.5: S11 -3.79,0; S12 3.79,0

### Placement (x,y rotation side)
C1  45.77,44.35 270 top
C2  50.6,21.64 180 top
C3  58.37,21.95 0 top
C4  7.32,50.19 0 top
C5  7.32,44.91 0 top
C6  34.85,22.66 270 top
C7  36.47,22.66 270 top
C8  7.92,6.3 180 top
C9  40.84,13.72 90 top
C10  33.22,22.66 270 top
C11  36.98,35.56 0 top
C12  59.54,26.42 90 top
C13  58.72,40.74 180 top
C14  60.76,35.36 180 top
C15  50.6,23.06 180 top
C16  43.48,11.18 0 top
C17  43.48,9.35 0 top
C18  43.48,7.32 0 top
C19  34.95,37.39 180 top
C20  38.1,22.66 270 top
C44  30.28,37.59 0 top
C46  24.38,24.38 180 top
C49  31.6,22.66 270 top
C51  35.97,25.81 270 top
C52  27.23,31.9 270 top
C53  27.64,39.42 0 top
C54  24.18,41.05 0 top
C55  24.18,36.17 0 top
C56  24.18,34.54 0 top
C57  24.18,29.26 180 top
C58  29.97,22.66 270 top
C59  27.03,22.66 270 top
D1  22.15,44.91 90 top
DFU  8.33,2.03 0 top
FB1  10uH  [0603']  34.24,25.81 270 top
FID5  93.12,4.67 0 top
FID6  4.22,6.91 0 top
FID17  87.83,47.85 0 top
FID18  10.52,50.39 0 top
FTDI  19.81,15.7 270 top
IC1  49.73,33.22 0 top
IC2  36.98,8.33 90 top
IC7  30.28,34.75 0 top
IC8  29.41,27.74 90 top
ISP  2.84,2.03 0 top
JTAG  49.23,9.04 0 top
L1  [0603']  42.47,13.82 270 top
LED1  70.71,10.57 270 top
LED2  67.46,10.57 270 top
LED3  64.21,10.57 270 top
LED4  60.96,10.57 270 top
LED5  55.68,10.57 270 top
LOGO1  LOGO-FIREPICKMEDIUM  [LOGO-FIREPICK-MEDIUM]  73.96,11.38 90 bottom
LOGO2  LOGO-OSHWSMALL  [LOGO-OSHW-SMALL]  73.96,25.15 90 bottom
LOGO3  LOGO-CC-BY-SAMEDIUM  [LOGO-CC-BY-SA-MEDIUM]  73.36,29.31 90 bottom
LOGO4  LOGO-FIREPICKMEDIUM  [LOGO-FIREPICK-MEDIUM]  88.39,14.63 90 top
LOGO6  88.8,31.75 90 top
LOGO10  88.19,28.4 90 top
PTC1  17.07,45.31 180 top
Q1  BSL207SP  [SC74_INFINEON]  33.32,42.27 90 top
Q2  55.68,17.88 180 top
Q3  29.46,17.88 0 top
R4  48.36,2.18 90 top
R5  69.65,41.86 0 top
R7  10.82,45.72 0 top
R8  7.32,46.74 0 top
R9  7.32,48.56 0 top
R10  68.48,18.9 90 top
R11  67.06,18.9 90 top
R12  65.63,18.9 90 top
R13  64.21,18.9 90 top
R14  57.81,10.77 270 top
R50  10.77,43.89 0 top
R51  22R  [R0603]  32.72,34.75 270 top
R52  34.24,29.16 270 top
R53  35.86,28.96 270 top
R54  24.18,39.42 180 top
R55  24.18,37.8 180 top
R56  24.18,32.92 180 top
R57  24.18,30.89 180 top
R58  22R  [R0603]  38.61,27.03 0 top
R59  22R  [R0603]  39.22,31.7 0 top
R60  22R  [R0603]  38.71,28.85 0 top
R61  7.32,42.67 0 top
R62  24.38,22.76 0 top
R63  24.38,26.01 0 top
R64  28.45,22.66 90 top
RJ1  10.87,32.97 90 top
RST  19.71,2.03 0 top
U1  0,0 0 top
X1  3.05,16.26 270 top
X2  1.42,47.35 270 top

### Tracks (layer width: path | path; a pad name or v marks a point on that pad's centre or on a via)
3.3V  (via drill 0.36)
  Top 0.203: 33.93,8.43 IC2.4 | v45.72,6.91 46.05,7.19 JTAG.1 46.74,7.14 46.74,5.49 48.36,3.86 R4.2 | C11.2 37.83,36.34 37.49,36.68 v37.19,36.68 36.47,37.39 C19.1 | IC1.84 40.67,35.22 v40.44,35.46 | v46.13,39.22 45.73,39.61 IC1.71 45.72,40.99 45.72,43.45 C1.2 | C13.2 56.79,40.74 v56.69,40.84 | C14.2 58.93,35.36 58.79,35.22 IC1.42 55.81,35.22 v55.68,35.36 | IC1.19 52.73,26.52 51.41,27.84 v50.7,27.84 50.49,28.04 49.58,28.04 49.38,27.84 49.38,26.92 49.73,26.57 IC1.13 | R14.2 v57.81,9.04 | IC1.28 57.51,28.25 v59.54,28.25 C12.2 | R5.2 v71.73,41.86 | v82.3,48.77 v82.3,46.74 | IC7.5 29.43,36.15 C44.1 28.41,37.55 v28.45,37.59 | L1.2 42.37,12.87 C9.1 40.81,12.9 37.08,12.9 v35.36,11.18 | 11.79,6.3 C8.1 8.74,6.34 | X1.4 3.15,16.26 v4.78,16.26 | IC1.54 54.23,38.99 v54.05,38.81 | IC8.9 33.12,27.49 | 33.12,27.49 34.24,27.49 | FB1.1 R52.2 34.24,27.49 | v33.12,27.23 33.12,27.49 | IC1.96 43.75,29.22 v43.89,29.36 | 34.24,27.49 35.97,27.49 | 35.97,27.49 C51.1 | R53.2 35.97,27.49 | v39.22,23.57 38.1,23.57 C20.1 C7.1 | Q1.4 31.36,43.22 v31.29,43.28
  Top 0.813: 35.56,4.47 U1.3.3V
  3.3 0.203: v57.81,9.04 57.91,8.94 | v71.73,41.86 71.93,41.86 | v28.45,37.59 28.45,37.8 | v31.29,43.28 31.09,43.28
  other vias: 35.76,9.14 34.34,7.32 34.34,8.53 33.53,11.18 34.34,9.55 31.9,9.96 33.32,8.94 31.9,8.33 33.32,6.91 31.9,6.71 33.32,7.92 10.77,6.3
  pour Top: 21.34,14.63 37.19,14.63 37.19,1.42 22.76,1.22 22.76,4.27 10.36,4.27 10.36,7.92 21.34,7.92
  pour 3.3 (rank 2): 0,53.44 99.16,53.44 99.16,0 0,0
  pour Bottom: 37.19,14.63 18.9,14.63 18.9,4.88 37.19,4.88
5V  (via drill 0.38, 0.51)
  Top 0.203: C16.1 42.63,10.36 | C18.1 C17.1 42.63,10.36 | v41.66,10.36 42.63,10.36
  Top 0.305: D1.C 21.39,43.33 v20.12,42.06
  Top 0.813: U1.5V 38.1,10.46 38.41,10.77 40.07,10.77 IC2.3 41.39,10.63 v41.66,10.36
  Bottom 0.813: U1.5V@2 U1.5V@1 90.93,47.75 87.58,47.75 86.77,46.94 86.77,11.18 84.12,8.13 43.89,8.13 v41.66,10.36 | v20.12,42.06 18.69,42.06 11.99,35.36 11.99,30.48 16.26,26.21 16.26,6.3 17.88,4.67 37.49,4.67 38.1,4.06 U1.5V
!RST  (via drill 0.36)
  Top 0.203: v45.62,23.47 45.31,23.16 45.31,15.04 46.63,13.72 50.29,13.72 51.77,12.24 JTAG.10 52.1,10.89 52.83,10.16 52.83,5.28 51.61,4.06 50.29,4.06 49.48,3.25 49.48,1.32 | 47.95,1.42 R4.1 | U1.RESET 33.02,0.81 | R4.1 48.35,1.32 47.35,1.32 46.84,0.81 33.02,0.81 | R4.1 49.48,1.32 | 49.48,1.32 49.99,0.81 64.21,0.81 64.72,1.32 65.53,1.32 66.04,0.81 74.57,0.81 74.98,1.22 v74.98,13.21 | IC1.17 51.73,24.26 52.02,23.98 52.53,23.98 v52.63,23.88 | v72.14,23.37 65.66,23.37 U1.RST | 33.02,0.81 21.54,0.81 RST.4 21.54,0.81 21.54,1.63 21.13,2.03 18.9,2.03 17.91,1.04 RST.3
  Bottom 0.203: v45.62,23.47 52.22,23.47 v52.63,23.88 | v74.98,13.21 74.98,17.68 72.14,20.52 v72.14,23.37
!RSTOUT  (via drill 0.36)
  Top 0.203: IC8.15 29.66,30.48 30.48,31.29 32.51,31.29 v32.92,30.89 | IC1.14 50.23,27.08 v49.99,27.33
  Bottom 0.203: v32.92,30.89 36.17,34.14 36.17,35.15 36.78,35.76 38,35.76 40.64,33.12 45.72,33.12 49.99,28.85 v49.99,27.33
AVCC  (via drill 0.36)
  Top 0.203: IC1.12 49.23,23.98 48.77,23.98 | IC1.10 48.23,24.31 48.56,23.98 48.77,23.98 | v48.97,20.12 48.97,20.32 48.77,20.52 48.77,23.16 | 48.77,23.16 48.77,23.98 | C15.2 48.87,23.06 48.77,23.16 | v41.76,19.3 41.66,19.2 41.66,18.49 40.64,17.48 40.64,15.85 41.05,15.44 41.45,15.44 42.23,14.67 L1.1
  Bottom 0.203: v41.76,19.3 42.57,20.12 v48.97,20.12
D_N
  Top 0.178: 4.17,47.93 arc45 4.15,47.97 X2.2
  Top 0.305: R9.1 6.42,48.56 arc45 5.97,48.38 5.71,48.12 arc-45 5.26,47.93 4.17,47.93
D_P
  Top 0.178: X2.3 arc45 4.15,47.36 4.17,47.37
  Top 0.305: R8.1 6.42,46.74 arc-45 5.97,46.92 5.71,47.19 arc45 5.26,47.37 4.17,47.37
ENET_CRS  (via drill 0.36)
  Top 0.203: R60.2 v40.44,28.85 | IC1.92 43.76,31.22 v43.89,31.09
  Bottom 0.203: v43.89,31.09 42.67,31.09 v40.44,28.85
ENET_MDC  (via drill 0.36)
  Top 0.203: IC8.13 30.96,29.74 v31.8,30.58 | v34.65,33.63 34.64,33.62 35.04,33.33 36.07,33.33 36.68,33.93 40.03,33.93 40.24,33.72 IC1.87
  Bottom 0.203: v31.8,30.58 31.8,30.79 v34.65,33.63
ENET_MDIO  (via drill 0.36)
  Top 0.203: IC8.12 31.93,28.99 32.51,29.57 32.96,29.97 R52.1 34.34,30.11 v34.54,30.89 | IC1.86 40.35,34.22 40.23,34.34 37.39,34.34 v37.19,34.54
  Bottom 0.203: v37.19,34.54 37.19,33.73 34.54,31.09 v34.54,30.89
ENET_REF_CLK
  Top 0.203: IC1.88 40.13,33.22 39.83,33.53 36.88,33.53 36.27,32.92 33.12,32.92 32.72,33.33 R51.2
ENET_RX_ER  (via drill 0.36)
  Top 0.203: IC1.89 39.62,32.72 v39.42,32.92 | IC8.10 33.07,27.99 33.33,28.25 33.33,28.96 33.53,29.16 34.95,29.16 35.26,29.46 35.52,29.46 R53.1 | 35.93,29.46 R53.1 | v35.46,30.79 35.87,30.38 R53.1
  Bottom 0.203: v39.42,32.92 39.42,32.51 37.69,30.79 v35.46,30.79
ENET_RXD0  (via drill 0.36)
  Top 0.203: IC1.91 43.61,31.72 v43.89,32 | v39.42,26.01 39.42,26.99 R58.2
  Bottom 0.203: v43.89,32 44.2,32 44.6,31.6 44.6,30.79 44.09,30.28 43.28,30.28 40.23,27.23 40.23,26.82 v39.42,26.01
ENET_RXD1
  Top 0.203: IC1.90 40.59,32.22 R59.2
ENET_TX_EN  (via drill 0.36)
  Top 0.203: IC8.16 29.16,30.59 30.28,31.7 35.76,31.7 v35.97,31.5 | IC1.93 37.76,30.72 37.39,31.09 v37.39,32.92
  Bottom 0.203: v35.97,31.5 v37.39,32.92
ENET_TXD0
  Top 0.203: IC8.17 28.66,30.7 30.07,32.11 36.37,32.11 36.58,31.9 36.58,30.68 37.54,29.72 IC1.95
ENET_TXD1
  Top 0.203: IC8.18 28.16,30.8 29.87,32.51 36.78,32.51 36.98,32.31 36.98,30.89 37.65,30.22 IC1.94
GND  (via drill 0.36, 0.38)
  Top 0.203: 25.4,34.14 C56.2 25.2,34.54 | v21.74,26.01 R63.1 C46.2 | C55.2 25.2,36.17 | 27.23,31.29 C52.2 27.23,30.07 v27.43,29.87 | 23.37,24.38 C46.2 | 47.95,5.69 JTAG.3 47.95,5.49 v49.17,4.17 | v51.21,27.03 50.73,26.55 IC1.15 50.73,24.45 51.41,23.77 51.41,23.1 C15.1 | IC1.11 48.73,27.19 v48.77,27.23 | X1.6 5.45,18.56 v5.49,18.59 | X1.ID 7.5,24.26 v7.52,24.28 | IC1.83 43.32,35.72 43.89,35.15 v43.89,34.65 | v44.7,42.98 44.7,42.88 45.23,42.35 IC1.72 45.23,39.54 45.11,39.42 | C13.1 61.67,40.74 v61.77,40.84 | C14.1 61.61,34.58 61.57,34.54 58.93,34.54 58.75,34.72 IC1.41 56.16,34.72 v55.78,34.34 | 21.48,3.25 RST.2 20.93,3.86 19.71,3.86 | 2.77,3.66 ISP.GND | 4.61,3.25 ISP.2 | RST.1 18.12,3.28 18.69,3.86 19.71,3.86 | RST.GND 19.71,3.86 | DFU.2 9.55,3.86 7.11,3.86 DFU.1 | C57.2 23.16,29.26 22.15,30.28 21.51,30.28 RJ1.GND | IC1.55 53.73,39.71 v53.24,39.22 | IC1.97 43.62,28.72 v43.89,28.45 | C59.2 27.13,21.81 v27.13,20.42 | C46.2 R62.1 | C58.2 C49.2 C10.2 C6.2 C7.2 C20.2 | v59.13,29.26 58.67,29.72 IC1.31 55.21,29.82
  Top 0.813: 40.64,5.73 IC2.1
  Bottom 0.203: 40.44,2.74 U1.GND@0
  other vias: 26.21,35.36 26.01,40.64 55.68,7.11 32.31,37.69 57.3,4.88 71.32,4.06 17.98,2.24 22.56,19.71 29.36,27.74 42.16,44.2 37.9,49.28 30.99,44.6 31.19,34.65 6.6,33.63 13.72,33.43 10.26,31.39 34.44,19.61 38.91,19.81 51,20.22 4.67,41.86 5.49,4.47 7.92,51.61 13.51,12.19 62.59,6.91 69.09,6.91 79.04,10.97 82.3,30.89 85.34,35.36 90.83,32.31 83.92,41.86 90.83,39.62 91.85,36.37 72.54,48.77 77.42,6.91 67.87,48.97 78.03,48.77 38,11.99 9.55,15.95 21.95,35.46 21.74,38.51 17.88,39.32 46.94,37.19 55.07,18.19 60.15,20.22 69.9,16.97 30.58,20.42 58.42,25.6 63.09,35.15 34.95,35.46 45.82,27.43 40.84,24.89 14.22,15.54 6.91,10.26 2.64,5.79 32.51,39.52 43.69,50.9 66.04,50.7 17.07,44.09 17.37,13 49.38,34.75 49.17,38.61 39.22,40.84 90.73,23.98 90.73,29.06 90.53,16.46 33.22,47.04
  pour Top (isolate 0.305, rank 2): 0,53.44 99.16,53.44 99.16,0 0,0
  pour Bottom (rank 2): 0,53.44 99.16,53.44 99.16,0 0,0
  pour Gnd: 0,53.44 99.16,53.44 99.16,0 0,0
LED1/REGOFF  (via drill 0.36)
  Top 0.203: RJ1.G+ 4.75,39.29 3.45,38 3.45,23.57 6.3,20.73 9.75,20.73 11.58,22.55 17.07,22.55 17.68,23.16 v17.68,23.98 | IC8.3 29.16,24.69 28.85,24.38 27.64,24.38 v27.43,24.49
  Bottom 0.203: v27.43,24.49 18.29,24.59 v17.68,23.98
LED2/NINTSEL
  Top 0.203: RJ1.Y+ 7.19,26.34 RJ1.Y++ 8.33,27.48 8.33,28.65 9.75,30.07 12.19,30.07 17.27,24.99 20.32,24.99 22.35,22.96 22.35,21.95 22.55,21.74 24.99,21.74 25.23,21.98 R62.2 26.01,22.76 26.21,22.96 26.21,24.18 27.23,25.2 27.64,25.2 28.04,24.79 28.45,24.79 28.65,24.99 28.65,25.73 IC8.2
N$1
  Top 0.203: IC1.22 54.23,24.16 53.65,23.57 53.65,21.64 | 53.65,21.64 53.65,21.13 51.41,18.9 51.41,18.44 Q2.2 | C2.1 53.65,21.64
N$2
  Top 0.203: IC1.23 54.73,24.05 54.25,23.57 54.25,21.13 56.08,19.3 | 56.08,19.3 57.51,17.88 Q2.1 | C3.1 57.52,20.74 56.08,19.3
N$3  (via drill 0.36)
  Top 0.203: IC8.11 32.45,28.49 v32.61,28.65 | R60.1 37.08,28.85 v36.98,28.96
  Bottom 0.203: v32.61,28.65 36.68,28.65 v36.98,28.96
N$4
  Top 0.203: IC8.24 26.28,26.49 25.81,26.01 R63.2
N$9  (via drill 0.38)
  Top 0.406: X2.1 5.16,48.65 5.38,48.87 v5.38,49.38
  Top 0.61: v13.41,45.31 PTC1.2 15.23,45.31
  Bottom 0.61: v13.41,45.31 9.45,45.31 v5.38,49.38
N$12
  Top 0.203: IC8.6 30.66,24.24 C49.1 C10.1
N$15  (via drill 0.36)
  Top 0.203: IC8.14 30.16,30.37 30.68,30.89 30.79,30.89 v30.79,30.68 | v30.28,34.54 IC7.2
  Bottom 0.203: v30.28,34.54 30.28,31.5 v30.79,30.68
N$20
  Top 0.203: RJ1.G- 7.19,37.05 RJ1.G-- 7.49,37.16 7.92,37.8 7.92,42.63 R61.2
N$42  (via drill 0.36)
  Top 0.203: IC8.8 31.94,26.99 v32.72,26.21 | R58.1 37.76,26.05 v37.8,26.01
  Bottom 0.203: 32.51,26.42 v32.72,26.21 32.92,26.01 v37.8,26.01
N$47
  Top 0.203: RJ1.Y- 6.02,29.18 8.84,32 8.84,37.29 8.33,37.8 8.33,39.62 11.58,42.88 11.58,43.85 R50.2
N$51
  Top 0.203: R7.2 12.39,45.72 12.6,45.52 12.6,44.09 13.41,43.28 16.05,43.28 18.29,41.05 21.34,41.05 22.55,42.27 Q1.5 | Q1.5 Q1.2 Q1.1 | Q1.5 Q1.6
N$55  (via drill 0.36)
  Top 0.203: IC8.7 31.41,25.69 | v38.41,32.92 38.41,31.74 R59.1
  Top 0.254: 31.41,25.69 v31.5,25.81
  Bottom 0.203: v31.5,25.81 31.5,28.45 33.73,30.68 33.73,31.09 36.58,33.93 36.58,34.95 36.98,35.36 37.8,35.36 38.41,34.75 v38.41,32.92 38.41,32.72
N$67
  Top 0.203: IC8.4 29.66,24.58 28.59,23.51 R64.2 C59.1 27.03,23.16 26.21,22.35 26.21,18.29 25.81,17.88 Q3.1
N$68
  Top 0.203: IC8.5 30.16,23.7 C58.1 29.67,23.2 29.67,23.06 28.45,21.84 R64.1 28.45,20.73 31.29,17.88 Q3.2
N$78
  Top 0.203: IC7.4 31.41,36.05 31.9,35.56 32.68,35.56 R51.1
N$80
  Top 0.203: LED5.A 57.06,12.37 R14.1
N$84  (via drill 0.36)
  Top 0.203: LED4.A v60.96,13.61 | v64.21,16.87 R13.1
  Bottom 0.203: v60.96,13.61 v64.21,16.87
N$85  (via drill 0.36)
  Top 0.203: LED3.A v64.21,13.61 | v65.63,16.87 R12.1
  Bottom 0.203: v64.21,13.61 64.21,15.44 v65.63,16.87
N$86  (via drill 0.36)
  Top 0.203: R11.1 v67.06,16.87 | v67.46,13.61 LED2.A
  Bottom 0.203: v67.06,16.87 67.06,14.02 v67.46,13.61
N$87  (via drill 0.36)
  Top 0.203: LED1.A v70.71,13.61 | v68.48,16.87 R10.1
  Bottom 0.203: v70.71,13.61 70.71,14.63 v68.48,16.87
P0[0]  (via drill 0.36)
  Top 0.203: v71.12,36.78 70.51,37.39 58.52,37.39 58.36,37.22 IC1.46 55.92,37.22 55.58,36.88 v50.7,36.88 | v39.42,46.63 39.32,46.63 36.58,49.38 U1.10
  3.3 0.203: v71.12,36.78 82.91,36.78 93.07,46.94 95.2,46.94 U1.23
  Bottom 0.203: v39.42,46.63 39.42,45.52 44.5,40.44 47.35,40.44 48.16,39.62 48.16,37.39 48.67,36.88 v50.7,36.88
P0[1]
  Top 0.203: U1.49 U1.48 71.42,37.8 58.32,37.8 58.25,37.72 IC1.47
P0[4]
  Top 0.203: IC1.81 39.48,36.72 38,38.2 38,43.69 41.66,47.35 U1.8
P0[5]
  Top 0.203: U1.7 45.52,50.8 45.31,50.6 45.31,50.39 38.41,43.48 38.41,38.41 39.59,37.22 IC1.80
P0[10]
  Top 0.203: IC1.48 78.62,38.22 U1.42 95.3,21.54 95.3,19.1 U1.46
P0[11]
  Top 0.203: U1.38 83.2,38.72 IC1.49
P0[15]  (via drill 0.36)
  Top 0.203: IC1.62 50.23,44.34 51.21,45.31 87.58,45.31 v87.78,45.11
  Bottom 0.203: U1.52 88.8,10.16 87.99,10.97 87.99,44.91 v87.78,45.11
P0[16]  (via drill 0.36)
  Top 0.203: IC1.63 49.73,44.45 51,45.72 87.38,45.72 v87.99,46.33
  Bottom 0.203: U1.44 89.81,20.32 89.2,20.93 89.2,43.69 89.81,44.3 89.81,45.72 89.2,46.33 v87.99,46.33
P0[17]  (via drill 0.36)
  Top 0.203: v88.49,45.62 88.49,44.91 88.09,44.5 87.17,44.5 86.77,44.91 51.41,44.91 50.73,44.23 IC1.61
  Bottom 0.203: U1.50 89.1,12.7 88.39,13.41 88.39,45.31 v88.49,45.62
P0[18]  (via drill 0.36)
  Top 0.203: v89.1,44.7 88.49,44.09 86.97,44.09 86.56,44.5 51.61,44.5 51.23,44.12 IC1.60
  Bottom 0.203: U1.51 95.2,14.02 89.61,14.02 88.8,14.83 88.8,44.4 v89.1,44.7
P0[19]
  Top 0.203: U1.22 91.95,48.26 89.81,46.13 89.81,44.5 89,43.69 86.77,43.69 86.36,44.09 52.02,44.09 51.73,43.81 IC1.59
P0[20]
  Top 0.203: IC1.58 52.22,40.98 52.22,43.48 52.43,43.69 86.16,43.69 86.56,43.28 89.2,43.28 91.64,45.72 U1.24
P0[21]
  Top 0.203: IC1.57 52.73,42.98 53.03,43.28 85.95,43.28 86.36,42.88 89.41,42.88 89.81,43.28 93.88,43.28 U1.26
  Bottom 0.203: U1.26 92.96,43.18 92.25,42.47 92.25,37.29 U1.32
P0[22]
  Top 0.203: IC1.56 53.24,42.67 53.44,42.88 85.75,42.88 86.16,42.47 92.15,42.47 U1.28
P0[23]  (via drill 0.36)
  Top 0.203: IC1.9 47.73,24.2 48.36,23.57 48.36,20.52 47.75,19.91 47.75,16.66 47.95,16.46 55.07,16.46 55.47,16.87 56.29,16.87 57.1,16.05 73.56,16.05 v73.76,16.26 | v73.76,13.21 73.76,2.64 U1.A8
  Bottom 0.203: v73.76,13.21 v73.76,16.26
P0[24]  (via drill 0.36)
  Top 0.203: IC1.8 47.23,24.09 47.95,23.37 47.95,20.73 47.35,20.12 47.35,16.26 47.55,16.05 55.68,16.05 v55.88,16.26 | v54.05,13.41 54.05,3.25 U1.A1
  Bottom 0.203: v55.88,16.26 55.88,15.24 v54.05,13.41
P0[25]  (via drill 0.36)
  Top 0.203: IC1.7 46.73,23.98 47.55,23.16 47.55,20.93 46.94,20.32 46.94,15.85 47.14,15.65 77.62,15.65 85.14,8.13 v85.75,8.13
  Bottom 0.203: v85.75,8.13 85.75,4.47 U1.A12
P0[26]  (via drill 0.36)
  Top 0.203: IC1.6 46.23,23.87 47.14,22.96 47.14,21.13 46.53,20.52 46.53,15.65 46.94,15.24 77.42,15.24 85.95,6.71 v86.77,6.71
  Bottom 0.203: v86.77,6.71 86.77,2.95 U1.A13
P1[18]  (via drill 0.36)
  Top 0.203: R10.2 v68.48,21.13 | IC1.32 59.79,30.22 v60.35,29.67
  Bottom 0.203: v68.48,21.13 68.48,21.54 67.26,22.76 62.79,22.76 60.35,25.2 v60.35,29.67
P1[19]  (via drill 0.36)
  Top 0.203: IC1.33 55.51,30.72 v55.47,30.68 | v67.06,21.13 R11.2
  Bottom 0.203: v55.47,30.68 55.27,30.68 55.07,30.48 55.07,29.87 56.69,28.25 58.32,28.25 59.94,26.62 59.94,24.99 62.59,22.35 66.24,22.35 67.06,21.54 v67.06,21.13
P1[20]  (via drill 0.36)
  Top 0.203: R12.2 v65.63,21.13 | IC1.34 56.56,31.22 56.49,31.29 v54.86,31.29
  Bottom 0.203: v65.63,21.13 65.63,21.54 65.23,21.95 62.38,21.95 59.54,24.79 59.54,26.42 58.12,27.84 56.49,27.84 54.66,29.67 54.66,31.09 v54.86,31.29
P1[21]  (via drill 0.36)
  Top 0.203: IC1.35 55.86,31.72 v55.47,32.11 | v64.21,21.13 R13.2
  Bottom 0.203: v55.47,32.11 54.66,32.11 54.25,31.7 54.25,29.46 56.29,27.43 57.91,27.43 59.13,26.21 59.13,24.59 62.18,21.54 64.01,21.54 64.21,21.34 v64.21,21.13
P1[22]  (via drill 0.36)
  Top 0.203: IC1.36 58.84,32.22 59.54,32.92 71.32,32.92 75.79,28.45 v75.79,20.12
  3.3 0.203: v75.79,20.12 75.79,2.95 U1.A9
P1[23]  (via drill 0.36)
  Top 0.203: IC1.37 58.73,32.72 59.33,33.33 71.53,33.33 76.81,28.04 v76.81,20.12
  3.3 0.203: v76.81,20.12 76.81,8.94 78.84,6.91 78.84,2.64 U1.A10
P1[24]  (via drill 0.36)
  Top 0.203: U1.A2 55.88,4.67 58.73,7.52 58.73,12.39 58.32,12.8 57.71,12.8 v57.51,13.01 | IC1.38 v55.47,33.22
  Bottom 0.203: v57.51,13.01 57.1,13.41 57.1,23.77 55.88,24.99 55.88,27.23 53.85,29.26 53.85,31.9 55.17,33.22 v55.47,33.22
P1[25]  (via drill 0.36)
  Top 0.203: v82.91,12.19 82.91,22.55 71.74,33.72 IC1.39
  3.3 0.203: U1.A11 81.28,10.57 v82.91,12.19
P1[26]  (via drill 0.36)
  Top 0.203: IC1.40 58.64,34.22 58.73,34.14 68.89,34.14 v69.09,34.34 | v72.54,12.39 72.54,7.52 70.1,5.08 67.06,5.08 66.04,4.06 U1.A6
  Bottom 0.203: v69.09,34.34 70.31,33.12 70.31,18.09 72.54,15.85 v72.54,12.39
P1[27]  (via drill 0.36)
  Top 0.203: IC1.43 58.69,35.72 59.13,36.17 68.48,36.17 v70.31,34.34 | U1.A7 68.58,4.37 68.89,4.67 70.31,4.67 72.95,7.32 72.95,11.38 v73.15,11.58
  Bottom 0.203: v70.31,34.34 70.71,33.93 70.71,18.29 73.15,15.85 v73.15,11.58
P1[28]  (via drill 0.36)
  Top 0.203: v70.1,35.76 69.29,36.58 58.93,36.58 58.58,36.22 IC1.44 50.95,36.22 v50.7,35.97 | v38.41,46.53 38.41,46.94 36.58,48.77 34.75,48.77 34.14,49.38 34.14,50.7 U1.11
  3.3 0.203: U1.25 95.3,44.5 91.24,44.5 83.11,36.37 72.34,36.37 71.73,35.76 v70.1,35.76
  Bottom 0.203: v38.41,46.53 38.41,45.92 44.3,40.03 46.94,40.03 47.75,39.22 47.75,36.98 48.77,35.97 v50.7,35.97
P1[29]  (via drill 0.36)
  Top 0.203: IC1.45 58.47,36.72 58.73,36.98 69.9,36.98 v71.93,34.95
  3.3 0.203: U1.27 96.42,43.18 95.1,41.86 89.2,41.86 83.31,35.97 72.95,35.97 v71.93,34.95
P1[30]  (via drill 0.36)
  Top 0.203: v46.02,21.95 45.72,21.64 45.72,15.24 46.53,14.43 77.01,14.43 U1.A14 | v46.94,27.84 48.16,29.06 51.41,29.06 53.73,26.73 IC1.21
  Bottom 0.203: v46.94,27.84 46.94,27.43 44.5,24.99 44.5,22.96 45.52,21.95 v46.02,21.95
P1[31]  (via drill 0.36)
  Top 0.203: U1.A15 88.9,5.08 86.97,5.08 77.22,14.83 46.74,14.83 46.13,15.44 46.13,20.73 46.74,21.34 46.74,22.45 v46.43,22.76 | v48.36,28.25 48.97,28.25 49.28,28.55 51.31,28.55 53.23,26.62 IC1.20
  Bottom 0.203: v48.36,28.25 44.91,24.79 44.91,23.16 45.31,22.76 v46.43,22.76
P2[0]
  Top 0.203: IC1.75 43.73,41.81 43.28,42.27 43.28,47.55 45.11,49.38 46.84,49.38 U1.6
P2[1]
  Top 0.203: IC1.74 44.23,41.92 43.69,42.47 43.69,47.35 45.31,48.97 47.14,48.97 47.55,49.38 49.38,49.38 U1.5
  3.3 0.203: U1.5 50.8,50.39 52.22,48.97 54.05,48.97 U1.3
P2[2]
  Top 0.203: IC1.73 44.73,42.03 44.09,42.67 44.09,47.14 45.52,48.56 47.35,48.56 47.75,48.97 51.61,48.97 53.34,50.7 U1.4
P2[3]
  Top 0.203: U1.2 56.19,48.56 48.36,48.56 46.74,46.94 46.74,42.47 46.23,41.97 IC1.70
P2[4]  (via drill 0.36)
  Top 0.203: IC1.69 46.73,39.83 46.94,39.62 v46.94,38.81 | U1.13 29.06,50.7 29.06,49.17 31.9,46.33 v36.07,46.33
  Bottom 0.203: v46.94,38.81 46.53,38.41 45.31,38.41 37.39,46.33 v36.07,46.33
P2[5]
  Top 0.203: IC1.68 47.23,44.39 50.19,47.35 65.13,47.35 U1.14
P2[6]
  Top 0.203: IC1.67 47.73,44.28 50.39,46.94 67.26,46.94 U1.15
P2[7]
  Top 0.203: IC1.66 48.23,44.17 50.6,46.53 74.47,46.53 U1.18
P2[8]
  Top 0.203: IC1.65 48.73,44.06 50.8,46.13 76.61,46.13 U1.19
P2[10]  (via drill 0.36)
  Top 0.203: U1.47 96.42,17.78 95.1,16.46 93.47,16.46 75.39,34.54 v75.39,34.95 | R5.1 v67.67,41.86 67.06,42.47 55.07,42.47 54.73,42.13 IC1.53 54.73,38.48 54.25,38 49.99,38 45.11,33.12 v45.11,32.11 | v17.68,10.57 v14.63,10.57 | ISP.4 4.67,0.81 v4.67,2.03 1.42,2.03 1.04,1.65 ISP.3 | v40.03,18.9 40.03,18.29 39.83,18.09 39.83,16.05 v38.81,15.04
  Bottom 0.203: v75.39,34.95 75.39,38.81 74.37,39.83 69.7,39.83 v67.67,41.86 | v38.81,15.04 38.61,15.24 34.14,15.24 33.33,14.43 22.55,14.43 22.15,14.02 22.15,11.38 21.34,10.57 v17.68,10.57 | v14.63,10.57 10.16,10.57 4.67,5.08 v4.67,2.03 | v40.03,18.9 40.03,21.95 41.86,23.77 41.86,25.2 44.7,28.04 44.7,30.07 45.11,30.48 v45.11,32.11
P2[11]
  Top 0.203: IC1.52 55.23,41.82 55.47,42.06 66.45,42.06 67.67,40.84 87.17,40.84 89.81,38.2 93.88,38.2 U1.30
P2[12]  (via drill 0.36)
  Top 0.203: U1.34 86.56,40.44 67.46,40.44 66.24,41.66 55.88,41.66 55.73,41.51 IC1.51 55.73,38.87 54.46,37.59 50.19,37.59 45.72,33.12 v45.72,31.5 | v40.64,19.71 40.84,19.51 40.84,18.49 40.23,17.88 40.23,15.34 v39.73,14.83 | v17.68,8.13 v14.63,8.13 | DFU.4 10.16,0.81 v10.16,2.03 6.91,2.03 6.53,1.65 DFU.3
  Bottom 0.203: U1.34 92.05,31.09 92.05,27.33 U1.40 | v40.64,19.71 40.44,19.91 40.44,21.74 42.27,23.57 42.27,24.99 45.11,27.84 45.11,29.87 45.52,30.28 45.52,31.29 v45.72,31.5 | v39.73,14.83 39.32,14.43 38.2,14.43 37.8,14.83 34.34,14.83 33.53,14.02 22.76,14.02 22.55,13.82 22.55,11.18 21.74,10.36 21.74,8.53 21.34,8.13 v17.68,8.13 | v10.16,2.03 10.16,4.27 14.02,8.13 v14.63,8.13
P2[13]
  Top 0.203: U1.36 85.24,39.22 IC1.50
P3[25]  (via drill 0.36)
  Top 0.203: v59.23,13.72 59.23,4.98 58.42,4.17 U1.A3 | v57.51,26.42 58.32,26.42 58.73,26.82 58.73,27.43 58.43,27.72 IC1.27
  Bottom 0.203: v59.23,13.72 57.91,15.04 57.91,24.18 57.51,24.59 v57.51,26.42
P3[26]  (via drill 0.36)
  Top 0.203: U1.A0 53.24,4.98 53.24,13.61 53.65,14.02 57.91,14.02 v58.32,13.61 | IC1.26 56.48,27.22 56.29,27.03 56.29,26.42 v56.49,26.21
  Bottom 0.203: v58.32,13.61 57.51,14.43 57.51,23.98 56.49,24.99 v56.49,26.21
P4[28]
  Top 0.203: IC1.82 39.37,36.22 37.59,38 37.59,43.89 40.23,46.53 40.23,47.95 39.22,48.97 39.22,50.7 U1.9
P4[29]
  Top 0.203: U1.12 31.5,49.38 32.51,48.36 36.37,48.36 37.19,47.55 37.19,37.8 40.26,34.72 IC1.85
RD+
  Top 0.203: IC8.23 21.91,26.99 21.74,26.82 17.68,26.82 15.24,29.26 15.24,32.89 RJ1.RD+ 21.21,34.87 21.54,34.54 C56.1 R56.2
RD-
  Top 0.203: IC8.22 21.59,27.49 21.34,27.23 17.88,27.23 15.65,29.46 15.65,30.28 16.43,31.06 RJ1.RD- 22.17,31.06 22.35,30.89 R57.2 24.96,29.34 C57.1
RTCK  (via drill 0.36)
  Top 0.203: 50.6,7.11 JTAG.7 50.6,7.09 v50.6,4.88 | IC1.100 42.06,27.23 42.47,27.23 42.67,27.03 42.67,26.01 43.28,25.4 43.28,12.6 v43.59,12.29
  Bottom 0.203: v50.6,4.88 44.91,4.88 40.64,9.14 40.64,10.97 41.96,12.29 v43.59,12.29
RX_0  (via drill 0.36)
  Top 0.203: v41.35,16.26 41.96,15.65 42.67,15.65 42.88,15.85 42.88,24.79 40.84,26.82 40.84,27.43 41.13,27.72 IC1.99 42.99,27.72 43.28,27.43 44.5,27.43 51.61,34.54 v54.66,34.54
  Bottom 0.203: FTDI.4 21.34,14.43 22.15,15.24 32.92,15.24 34.14,16.46 41.15,16.46 v41.35,16.26 | U1.0 61.37,48.67 61.37,43.48 54.97,37.08 54.97,34.85 v54.66,34.54
SCL  (via drill 0.36)
  Top 0.203: IC1.24 55.23,26.35 54.86,26.72 54.36,26.72 53.85,27.23 v53.85,27.74 | U1.SCL1 18.8,50.29 21.13,47.95 29.06,47.95 32.21,44.81 v36.07,44.81
  3.3 0.203: U1.21 86.36,48.56 85.34,47.55 43.89,47.55 41.45,45.11 37.29,45.11 36.98,44.81 v36.07,44.81
  Bottom 0.203: v53.85,27.74 53.85,28.04 44.5,37.39 44.5,38 37.69,44.81 v36.07,44.81
SD_CS  (via drill 0.36)
  Top 0.203: X1.2 3.12,14.22 14.02,14.22 14.63,14.83 17.27,14.83 v17.48,14.63 | IC1.79 43.62,37.72 v43.79,37.8
  Bottom 0.203: v17.48,14.63 17.48,14.83 18.29,15.65 32.72,15.65 33.93,16.87 51.82,16.87 56.69,21.74 56.69,23.57 53.24,27.03 53.24,28.04 43.69,37.59 v43.79,37.8
SD_MISO  (via drill 0.36)
  Top 0.203: IC1.77 40.15,38.72 v40.03,38.61 | X1.7 13.36,19.66 14.43,20.73 v17.68,20.73 | v54.86,22.45 54.86,23.57 55.27,23.98 61.16,23.98 61.37,24.18 61.37,27.64 63.63,29.9 U1.MISO
  Bottom 0.203: v40.03,38.61 40.44,38.2 41.25,38.2 52.02,27.43 52.02,25.6 54.86,22.86 v54.86,22.45 54.86,21.74 51.21,18.09 33.33,18.09 32.11,16.87 23.16,16.87 21.74,18.29 21.74,20.32 21.34,20.73 v17.68,20.73
SD_MOSI  (via drill 0.36)
  Top 0.203: v40.44,40.23 40.44,39.42 40.64,39.22 IC1.76 | X1.3 4.69,15.26 6.3,16.87 16.46,16.87 17.68,15.65 21.34,15.65 v21.95,16.26 | U1.MOSI 64.85,26.62 62.79,26.62 62.18,26.01 62.18,23.77 61.57,23.16 56.69,23.16 56.08,22.55 v56.08,22.35
  Bottom 0.203: v40.44,40.23 52.83,27.84 52.83,26.82 56.08,23.57 v56.08,22.35 56.08,21.74 51.61,17.27 33.73,17.27 32.51,16.05 22.15,16.05 v21.95,16.26
SD_SCK  (via drill 0.36)
  Top 0.203: IC1.78 41.07,38.22 40.74,37.9 39.52,37.9 39.22,38.2 v39.22,39.42 | v17.48,17.48 3.07,17.48 X1.5 | U1.SCK 62.28,27.94 61.77,27.43 61.77,23.98 61.37,23.57 56.08,23.57 v55.47,23.06
  Bottom 0.203: v39.22,39.42 40.64,39.42 52.43,27.64 52.43,26.21 v55.47,23.06 55.47,21.74 51.41,17.68 33.53,17.68 32.31,16.46 22.96,16.46 21.13,18.29 18.29,18.29 v17.48,17.48
SDA  (via drill 0.36)
  Top 0.203: IC1.25 55.73,26.46 v54.76,27.43 | U1.SDA1 21.34,48.97 21.95,48.36 29.26,48.36 32,45.62 v34.54,45.62
  3.3 0.203: U1.20 83.82,48.87 82.91,47.95 43.69,47.95 41.35,45.62 v34.54,45.62
  Bottom 0.203: v54.76,27.43 54.76,27.74 44.91,37.59 44.91,38.2 37.49,45.62 v34.54,45.62
TCK-SWDCLK
  Top 0.203: JTAG.4 47.95,12.6 47.75,12.8 46.94,12.8 44.91,14.83 44.91,23.77 45.72,24.59 45.72,25.4 IC1.5
TD+  (via drill 0.36)
  Top 0.203: C54.1 R54.2 19.23,39.42 RJ1.TD+ | IC8.21 21.59,27.99 v21.34,28.25
  Bottom 0.203: v21.34,28.25 21.34,28.04 20.52,27.23 17.88,27.23 15.24,29.87 15.24,35.43 RJ1.TD+
TD-  (via drill 0.36)
  Top 0.203: RJ1.TD- 20.34,36.14 20.73,36.17 C55.1 R55.2 | IC8.20 26.25,28.49 26.21,28.45 22.55,28.45 v21.95,29.06
  Bottom 0.203: v21.95,29.06 21.95,33.96 RJ1.TD-
TDI  (via drill 0.36)
  Top 0.203: JTAG.8 50.6,10.97 50.6,11.79 49.58,12.8 v49.17,12.8 | v45.52,12.6 44.09,14.02 44.09,24.18 44.23,24.32 IC1.2
  Bottom 0.203: v49.17,12.8 48.97,12.6 v45.52,12.6
TDO-SWO
  Top 0.203: JTAG.6 49.17,10.77 49.17,9.96 48.36,9.14 46.33,9.14 45.72,9.75 45.72,11.28 43.69,13.31 43.69,24.38 43.73,24.43 IC1.1
TMS-SWDIO
  Top 0.203: IC1.3 44.7,25.4 44.7,24.18 44.5,23.98 44.5,14.63 46.74,12.39 46.74,10.97 JTAG.2
TX_0  (via drill 0.36)
  Top 0.203: v42.27,16.26 42.47,16.46 42.47,24.59 40.44,26.62 40.44,27.64 41.02,28.22 IC1.98 43.1,28.22 43.48,27.84 44.3,27.84 51.82,35.36 v54.25,35.36
  Bottom 0.203: v42.27,16.26 42.27,16.05 41.86,15.65 33.93,15.65 33.12,14.83 22.35,14.83 21.74,14.22 21.74,12.19 21.34,11.79 19.91,11.79 FTDI.5 | v54.25,35.36 54.25,36.98 60.96,43.69 U1.1
USB_CONNECT  (via drill 0.36)
  Top 0.203: v39.12,42.27 40.84,42.27 45.11,38 47.35,38 47.75,38.41 47.75,39.42 47.95,39.62 48.97,39.62 49.23,39.89 IC1.64 | v36.27,43.18 34.56,43.18 Q1.3
  Bottom 0.203: v39.12,42.27 37.19,42.27 v36.27,43.18
USB_N  (via drill 0.36)
  Top 0.305: IC1.30 55.59,29.22 arc-90 53.11,31.7 53.11,32.92 v53.29,32.92 | v11.58,47.8 11.58,47.62 10.02,47.62 arc-45 9.57,47.81 9,48.38 arc45 8.55,48.56 R9.2 C4.2
  Bottom 0.305: v11.58,47.8 11.58,47.62 19.48,47.62 arc45 20.37,48 20.44,48.07 arc-45 21.34,48.44 41.65,48.44 arc-45 42.55,48.07 49.07,41.55 arc90 49.82,41.55 49.84,41.57 arc-90 50.59,41.57 50.87,41.29 arc-90 50.87,40.54 50.85,40.52 arc90 50.85,39.77 52.74,37.88 arc-45 53.11,36.98 53.11,32.92 v53.29,32.92
USB_P  (via drill 0.36)
  Top 0.305: IC1.29 55.53,28.72 arc-90 52.55,31.7 52.55,32.92 v52.38,32.92 | 10.16,47.07 11.58,47.07 v11.58,46.89 11.65,46.82 | 10.16,47.07 10.02,47.07 arc45 9.57,46.88 arc-45 9.22,46.74 R8.2 C5.2 | R7.1 9.97,46.88 10.16,47.07
  Bottom 0.305: v11.58,46.89 11.58,47.07 19.71,47.07 arc45 20.61,47.44 20.67,47.51 arc-45 21.57,47.88 41.42,47.88 arc-45 42.32,47.51 | v52.38,32.92 52.55,32.92 52.55,36.81 arc45 52.23,37.6 42.32,47.51 | 42.32,47.51 42.27,47.55
VDD  (via drill 0.36)
  Top 0.203: IC8.19 27.1,28.99 | R57.1 R56.1 25.23,32.72 27.19,32.72 | R57.1 25.03,31.86 24.99,31.9 | R57.1 25.81,30.89 26.21,30.48 v26.21,29.67 | C52.1 28.21,32.75 v28.25,32.72 | C53.1 R54.1 R55.1 v26.01,37.8 26.11,37.8 26.72,38.41 26.72,39.32 26.82,39.42 | IC8.1 28.03,25.6 v26.62,25.6 26.62,25.2 25.81,24.38 C46.1 | v32.11,24.99 34.2,24.99 FB1.2 34.85,24.35 C6.1
  Top 0.305: RJ1.P5 17.91,32.33 19.18,33.6 RJ1.P4 | IC8.19 26.49,28.99 26.21,29.26 | IC8.1 28.16,25.32
  Top 0.406: 26.21,29.26 v26.21,29.67 | 27.19,32.72 C52.1
  3.3 0.203: v28.25,32.72 28.25,33.12 | v26.01,37.8 26.42,37.8
  pour 3.3 (isolate 0.254): 16.05,38.61 26.42,38.61 28.85,33.53 32.31,26.62 32.31,24.59 22.76,24.59 22.76,27.23 16.05,27.23
VUSB
  Top 0.305: D1.A 22.16,45.31 PTC1.1

### Text on the board
Bottom: MotionBoard.io | Designed in Australia / by Paul Jones | Smoothie and Ramps 1.4 / Compatible - Rev B
tPlace: Black
bPlace: Black | FTDI | Power | 1 2 3 4 | ISP | DFU | RST
tNames: QA | MotionBoard.io | Smoothie and Ramps 1.4 / Compatible - Rev B
bStop: MotionBoard.io | Designed in Australia / by Paul Jones | Smoothie and Ramps 1.4 / Compatible - Rev B